# Altium project sd2snes.PrjPcb
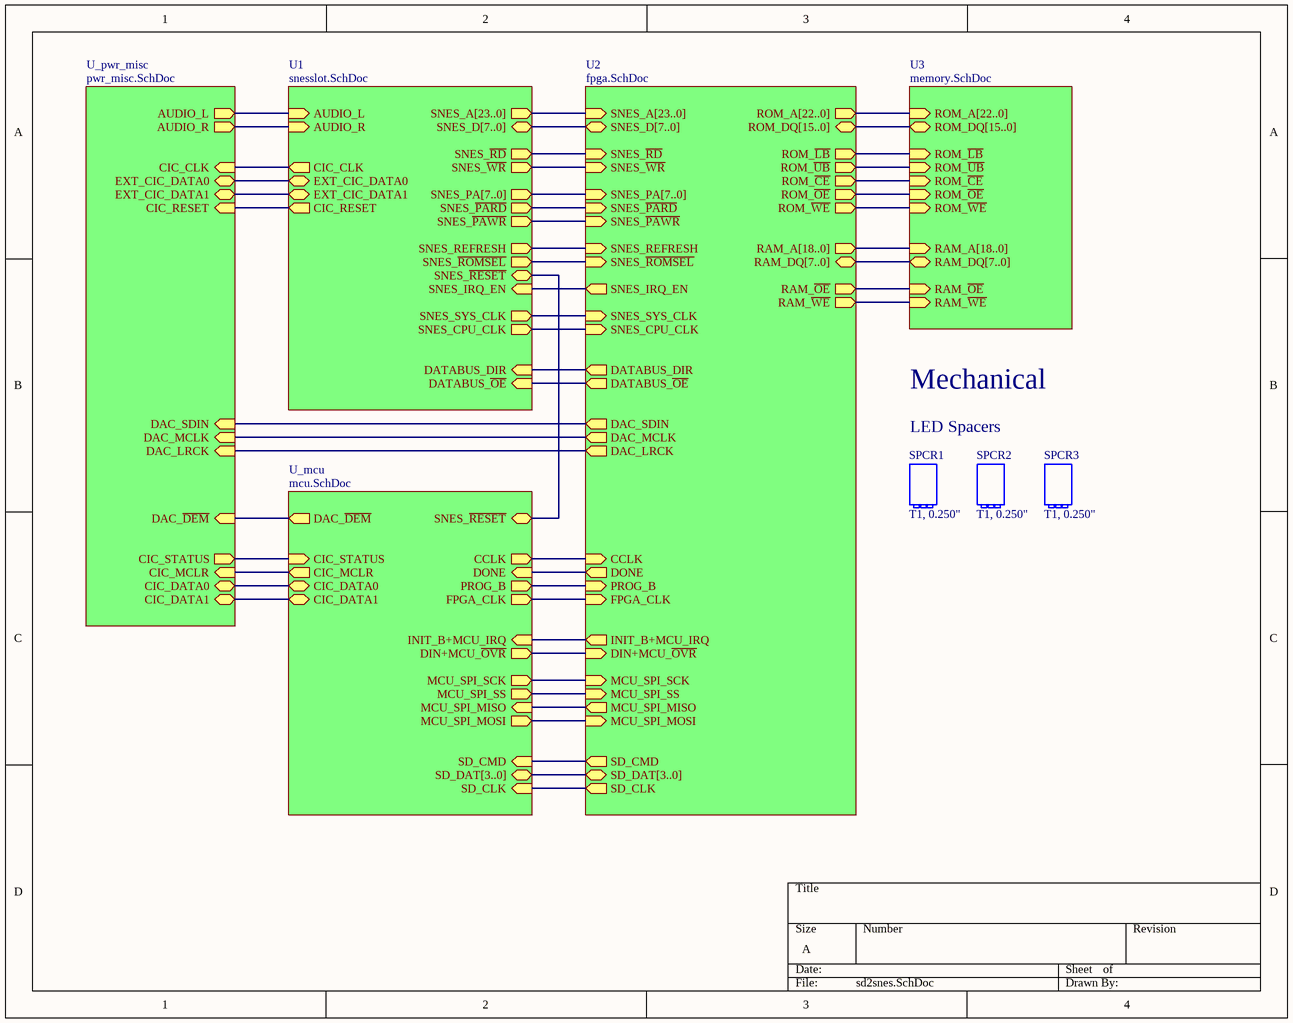
[diagram p0: sd2snes.SchDoc]
6 sheets, 156 parts. Net scope: hierarchical (ports join the sheet entries above them; power ports are global).
Board file: sd2snes.PcbDoc
Sheets:
  sd2snes.SchDoc
    U1 = snesslot.SchDoc
    U2 = fpga.SchDoc
    U3 = memory.SchDoc
    U_mcu = mcu.SchDoc
    U_pwr_misc = pwr_misc.SchDoc

## Sheet sd2snes.SchDoc
size A

### Parts
SPCR1  T1, 0.250"  (mechanical)
SPCR2  T1, 0.250"  (mechanical)
SPCR3  T1, 0.250"  (mechanical)

### Sub-sheets
U1 = snesslot.SchDoc: SNES_~{PARD} (out), SNES_~{PAWR} (out), SNES_REFRESH (out), SNES_SYS_CLK (out), SNES_~{RD} (out), SNES_~{ROMSEL} (out), SNES_IRQ_EN (in), SNES_~{RESET} (bidir), EXT_CIC_DATA1 (bidir), EXT_CIC_DATA0 (bidir), CIC_CLK (out), CIC_RESET (out), AUDIO_L (in), AUDIO_R (in), SNES_~{WR} (out), SNES_CPU_CLK (out), DATABUS_~{OE} (in), DATABUS_DIR (in), SNES_D[7..0] (bidir), SNES_A[23..0] (out), SNES_PA[7..0] (out)
U2 = fpga.SchDoc: ROM_~{WE} (out), ROM_~{OE} (out), ROM_~{UB} (out), ROM_~{CE} (out), SNES_SYS_CLK (in), ROM_~{LB} (out), SNES_REFRESH (in), SNES_~{PAWR} (in), SNES_~{PARD} (in), SNES_~{ROMSEL} (in), SNES_~{RD} (in), SNES_IRQ_EN (out), DATABUS_DIR (out), DATABUS_~{OE} (out), FPGA_CLK (in), INIT_B+MCU_IRQ (out), DIN+MCU_~{OVR} (in), SNES_~{WR} (in), SNES_CPU_CLK (in), MCU_SPI_SCK (in), DAC_SDIN (out), SD_CLK (out), MCU_SPI_SS (in), SD_CMD (out), MCU_SPI_MOSI (in), MCU_SPI_MISO (out), DAC_LRCK (out), DAC_MCLK (out), RAM_~{WE} (out), RAM_~{OE} (out), PROG_B (in), DONE (out), CCLK (in), ROM_A[22..0] (out), RAM_DQ[7..0] (bidir), ROM_DQ[15..0] (bidir), RAM_A[18..0] (out), SD_DAT[3..0] (bidir), SNES_PA[7..0] (in), SNES_D[7..0] (bidir), SNES_A[23..0] (in)
U3 = memory.SchDoc: ROM_~{CE} (in), ROM_~{OE} (in), ROM_~{WE} (in), ROM_A[22..0] (in), ROM_~{LB} (in), ROM_~{UB} (in), ROM_DQ[15..0] (bidir), RAM_A[18..0] (in), RAM_DQ[7..0] (bidir), RAM_~{OE} (in), RAM_~{WE} (in)
U_mcu = mcu.SchDoc: INIT_B+MCU_IRQ (in), DIN+MCU_~{OVR} (out), SNES_~{RESET} (bidir), CIC_STATUS (in), CIC_MCLR (out), DAC_~{DEM} (out), PROG_B (out), DONE (in), MCU_SPI_MOSI (out), MCU_SPI_MISO (in), MCU_SPI_SS (out), MCU_SPI_SCK (out), CCLK (out), FPGA_CLK (out), CIC_DATA1 (bidir), CIC_DATA0 (bidir), SD_DAT[3..0] (bidir), SD_CMD (in), SD_CLK (in)
U_pwr_misc = pwr_misc.SchDoc: CIC_CLK (in), CIC_STATUS (out), CIC_MCLR (in), CIC_DATA0 (bidir), CIC_DATA1 (bidir), EXT_CIC_DATA0 (bidir), EXT_CIC_DATA1 (bidir), CIC_RESET (in), DAC_SDIN (in), DAC_~{DEM} (in), DAC_LRCK (in), DAC_MCLK (in), AUDIO_R (out), AUDIO_L (out)

### Nets
AUDIO_L: sheet U1/AUDIO_L, sheet U_pwr_misc/AUDIO_L
AUDIO_R: sheet U1/AUDIO_R, sheet U_pwr_misc/AUDIO_R
CIC_CLK: sheet U1/CIC_CLK, sheet U_pwr_misc/CIC_CLK
CIC_DATA0: sheet U_mcu/CIC_DATA0, sheet U_pwr_misc/CIC_DATA0
CIC_DATA1: sheet U_mcu/CIC_DATA1, sheet U_pwr_misc/CIC_DATA1
CIC_MCLR: sheet U_mcu/CIC_MCLR, sheet U_pwr_misc/CIC_MCLR
CIC_RESET: sheet U1/CIC_RESET, sheet U_pwr_misc/CIC_RESET
CIC_STATUS: sheet U_mcu/CIC_STATUS, sheet U_pwr_misc/CIC_STATUS
DAC_~{DEM}: sheet U_mcu/DAC_~{DEM}, sheet U_pwr_misc/DAC_~{DEM}
DAC_LRCK: sheet U2/DAC_LRCK, sheet U_pwr_misc/DAC_LRCK
DAC_MCLK: sheet U2/DAC_MCLK, sheet U_pwr_misc/DAC_MCLK
DAC_SDIN: sheet U2/DAC_SDIN, sheet U_pwr_misc/DAC_SDIN
DATABUS_DIR: sheet U1/DATABUS_DIR, sheet U2/DATABUS_DIR
DATABUS_~{OE}: sheet U1/DATABUS_~{OE}, sheet U2/DATABUS_~{OE}
DIN+MCU_~{OVR}: sheet U2/DIN+MCU_~{OVR}, sheet U_mcu/DIN+MCU_~{OVR}
DONE: sheet U2/DONE, sheet U_mcu/DONE
EXT_CIC_DATA0: sheet U1/EXT_CIC_DATA0, sheet U_pwr_misc/EXT_CIC_DATA0
EXT_CIC_DATA1: sheet U1/EXT_CIC_DATA1, sheet U_pwr_misc/EXT_CIC_DATA1
FPGA_CLK: sheet U2/FPGA_CLK, sheet U_mcu/FPGA_CLK
INIT_B+MCU_IRQ: sheet U2/INIT_B+MCU_IRQ, sheet U_mcu/INIT_B+MCU_IRQ
MCU_SPI_MISO: sheet U2/MCU_SPI_MISO, sheet U_mcu/MCU_SPI_MISO
MCU_SPI_MOSI: sheet U2/MCU_SPI_MOSI, sheet U_mcu/MCU_SPI_MOSI
MCU_SPI_SCK: sheet U2/MCU_SPI_SCK, sheet U_mcu/MCU_SPI_SCK
MCU_SPI_SS: sheet U2/MCU_SPI_SS, sheet U_mcu/MCU_SPI_SS
PROG_B: sheet U2/PROG_B, sheet U_mcu/PROG_B
RAM_~{OE}: sheet U2/RAM_~{OE}, sheet U3/RAM_~{OE}
RAM_~{WE}: sheet U2/RAM_~{WE}, sheet U3/RAM_~{WE}
ROM_~{CE}: sheet U2/ROM_~{CE}, sheet U3/ROM_~{CE}
ROM_~{LB}: sheet U2/ROM_~{LB}, sheet U3/ROM_~{LB}
ROM_~{OE}: sheet U2/ROM_~{OE}, sheet U3/ROM_~{OE}
ROM_~{UB}: sheet U2/ROM_~{UB}, sheet U3/ROM_~{UB}
ROM_~{WE}: sheet U2/ROM_~{WE}, sheet U3/ROM_~{WE}
SD_CLK: sheet U2/SD_CLK, sheet U_mcu/SD_CLK
SD_CMD: sheet U2/SD_CMD, sheet U_mcu/SD_CMD
SNES_CPU_CLK: sheet U1/SNES_CPU_CLK, sheet U2/SNES_CPU_CLK
SNES_IRQ_EN: sheet U1/SNES_IRQ_EN, sheet U2/SNES_IRQ_EN
SNES_~{PARD}: sheet U1/SNES_~{PARD}, sheet U2/SNES_~{PARD}
SNES_~{PAWR}: sheet U1/SNES_~{PAWR}, sheet U2/SNES_~{PAWR}
SNES_~{RD}: sheet U1/SNES_~{RD}, sheet U2/SNES_~{RD}
SNES_~{RESET}: sheet U1/SNES_~{RESET}, sheet U_mcu/SNES_~{RESET}
SNES_~{ROMSEL}: sheet U1/SNES_~{ROMSEL}, sheet U2/SNES_~{ROMSEL}
SNES_REFRESH: sheet U1/SNES_REFRESH, sheet U2/SNES_REFRESH
SNES_SYS_CLK: sheet U1/SNES_SYS_CLK, sheet U2/SNES_SYS_CLK
SNES_~{WR}: sheet U1/SNES_~{WR}, sheet U2/SNES_~{WR}
NetR405_1: sheet U2/CCLK, sheet U_mcu/CCLK

### Buses and harness runs
bus sheet U1/SNES_A[23..0] = sheet U2/SNES_A[23..0]
bus sheet U1/SNES_D[7..0] = sheet U2/SNES_D[7..0]
bus sheet U1/SNES_PA[7..0] = sheet U2/SNES_PA[7..0]
bus sheet U2/RAM_A[18..0] = sheet U3/RAM_A[18..0]
bus sheet U2/RAM_DQ[7..0] = sheet U3/RAM_DQ[7..0]
bus sheet U2/ROM_A[22..0] = sheet U3/ROM_A[22..0]
bus sheet U2/ROM_DQ[15..0] = sheet U3/ROM_DQ[15..0]
bus sheet U2/SD_DAT[3..0] = sheet U_mcu/SD_DAT[3..0]

### Notes on the sheet
- Mechanical
- LED Spacers

### Library data of the parts
SPCR1-SPCR3 = LED_SPACER: LED Spacer; Value: T1, 0.250"

## Sheet snesslot.SchDoc: SD2SNES
size C; DrawnBy: Gargan; Revision: I; SheetNumber: 2; SheetTotal: 6
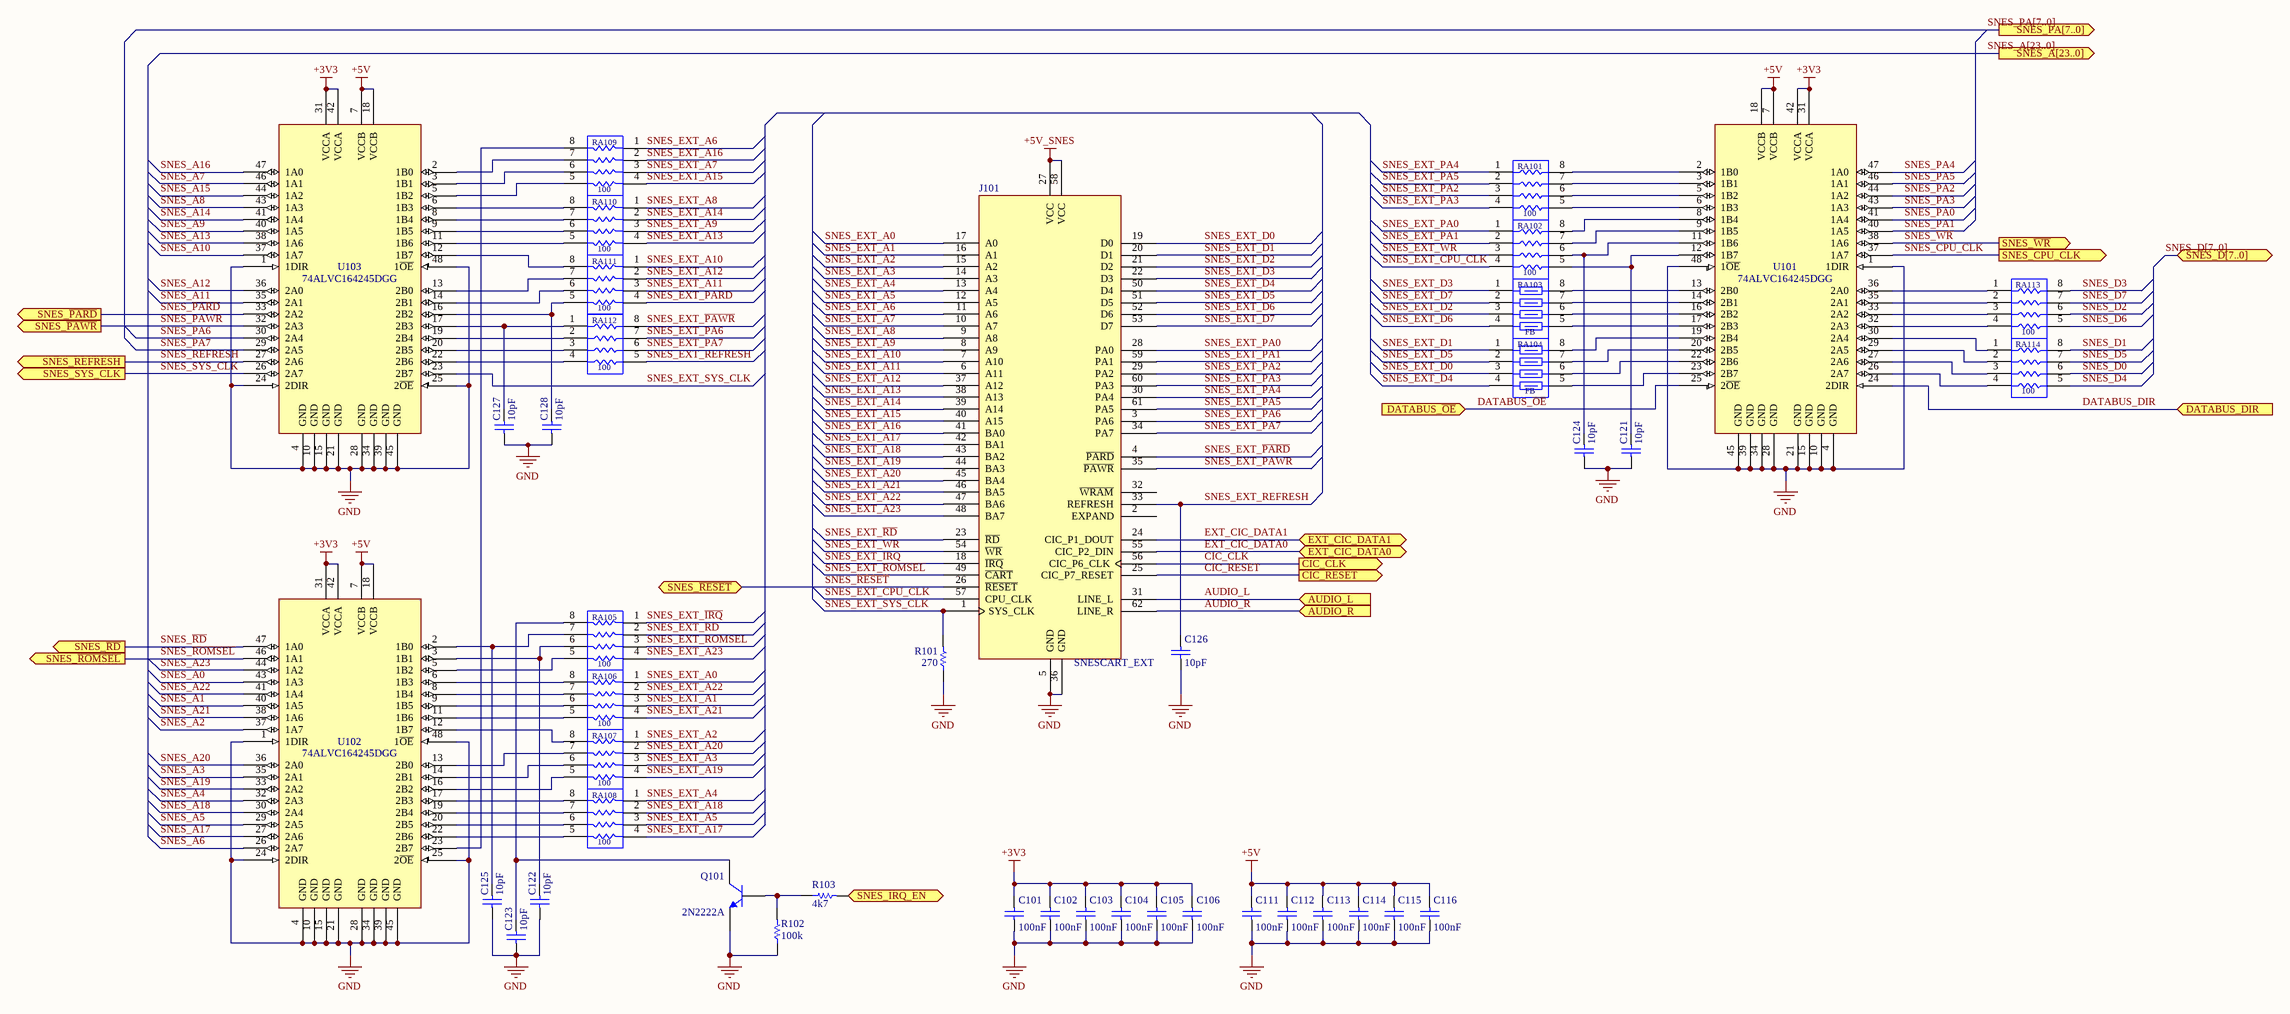
[diagram p1: snesslot.SchDoc]

### Parts
C101  100nF  [SM0805]
C102  100nF  [SM0805]
C103  100nF  [SM0805]
C104  100nF  [SM0805]
C105  100nF  [SM0805]
C106  100nF  [SM0805]
C111  100nF  [SM0805]
C112  100nF  [SM0805]
C113  100nF  [SM0805]
C114  100nF  [SM0805]
C115  100nF  [SM0805]
C116  100nF  [SM0805]
C121  10pF  [SM0805]
C122  10pF  [SM0805]
C123  10pF  [SM0805]
C124  10pF  [SM0805]
C125  10pF  [SM0805]
C126  10pF  [SM0805]
C127  10pF  [SM0805]
C128  10pF  [SM0805]
J101  SNESCART_EXT  [SNESCART_EDGE_CONN]
Q101  2N2222A  [SOT23EBC]
R101  270  [SM0805]
R102  100k  [SM0805]
R103  4k7  [SM0805]
RA101  100  [R_PACK_1206_2]
RA102  100  [R_PACK_1206_2]
RA103  FB  [R_PACK_1206_2]
RA104  FB  [R_PACK_1206_2]
RA105  100  [R_PACK_1206_2]
RA106  100  [R_PACK_1206_2]
RA107  100  [R_PACK_1206_2]
RA108  100  [R_PACK_1206_2]
RA109  100  [R_PACK_1206_2]
RA110  100  [R_PACK_1206_2]
RA111  100  [R_PACK_1206_2]
RA112  100  [R_PACK_1206_2]
RA113  100  [R_PACK_1206_2]
RA114  100  [R_PACK_1206_2]
U101  74ALVC164245DGG  [TSSOP48]
U102  74ALVC164245DGG  [TSSOP48]
U103  74ALVC164245DGG  [TSSOP48]

### Ports
AUDIO_L (in), AUDIO_R (in), CIC_CLK (out), CIC_RESET (out), DATABUS_DIR (in), DATABUS_~{OE} (in), EXT_CIC_DATA0 (bidir), EXT_CIC_DATA1 (bidir), SNES_A[23..0] (out), SNES_CPU_CLK (out), SNES_D[7..0] (bidir), SNES_IRQ_EN (in), SNES_PA[7..0] (out), SNES_REFRESH (out), SNES_SYS_CLK (out), SNES_~{PARD} (out), SNES_~{PAWR} (out), SNES_~{RD} (out), SNES_~{RESET} (bidir), SNES_~{ROMSEL} (out), SNES_~{WR} (out)

### Nets
+3V3: C101.2 C102.2 C103.2 C104.2 C105.2 C106.2 U101.31(VCCA) U101.42(VCCA) U102.31(VCCA) U102.42(VCCA) U103.31(VCCA) U103.42(VCCA)
+5V: C111.2 C112.2 C113.2 C114.2 C115.2 C116.2 U101.7(VCCB) U101.18(VCCB) U102.7(VCCB) U102.18(VCCB) U103.7(VCCB) U103.18(VCCB)
+5V_SNES: J101.27(VCC) J101.58(VCC)
GND: C101.1 C102.1 C103.1 C104.1 C105.1 C106.1 C111.1 C112.1 C113.1 C114.1 C115.1 C116.1 C121.1 C122.1 C123.1 C124.1 C125.1 C126.2 C127.1 C128.1 J101.5(GND) J101.36(GND) Q101.2(E) R101.1 R102.1 U101.1(1DIR) U101.4(GND) U101.10(GND) U101.15(GND) U101.21(GND) U101.28(GND) U101.34(GND) U101.39(GND) U101.45(GND) U101.48(1~{OE}) U102.1(1DIR) U102.4(GND) U102.10(GND) U102.15(GND) U102.21(GND) U102.24(2DIR) U102.25(2~{OE}) U102.28(GND) U102.34(GND) U102.39(GND) U102.45(GND) U102.48(1~{OE}) U103.1(1DIR) U103.4(GND) U103.10(GND) U103.15(GND) U103.21(GND) U103.24(2DIR) U103.25(2~{OE}) U103.28(GND) U103.34(GND) U103.39(GND) U103.45(GND) U103.48(1~{OE})
AUDIO_L: J101.31(LINE_L) ; port AUDIO_L
AUDIO_R: J101.62(LINE_R) ; port AUDIO_R
CIC_CLK: J101.56(CIC_P6_CLK) ; port CIC_CLK
CIC_RESET: J101.25(CIC_P7_RESET) ; port CIC_RESET
DATABUS_DIR: U101.24(2DIR) ; port DATABUS_DIR
DATABUS_~{OE}: U101.25(2~{OE}) ; port DATABUS_~{OE}
EXT_CIC_DATA0: J101.55(CIC_P2_DIN) ; port EXT_CIC_DATA0
EXT_CIC_DATA1: J101.24(CIC_P1_DOUT) ; port EXT_CIC_DATA1
SNES_A0: U102.43(1A3)
SNES_A1: U102.40(1A5)
SNES_A2: U102.37(1A7)
SNES_A3: U102.35(2A1)
SNES_A4: U102.32(2A3)
SNES_A5: U102.29(2A5)
SNES_A6: U102.26(2A7)
SNES_A7: U103.46(1A1)
SNES_A8: U103.43(1A3)
SNES_A9: U103.40(1A5)
SNES_A10: U103.37(1A7)
SNES_A11: U103.35(2A1)
SNES_A12: U103.36(2A0)
SNES_A13: U103.38(1A6)
SNES_A14: U103.41(1A4)
SNES_A15: U103.44(1A2)
SNES_A16: U103.47(1A0)
SNES_A17: U102.27(2A6)
SNES_A18: U102.30(2A4)
SNES_A19: U102.33(2A2)
SNES_A20: U102.36(2A0)
SNES_A21: U102.38(1A6)
SNES_A22: U102.41(1A4)
SNES_A23: U102.44(1A2)
SNES_CPU_CLK: U101.37(1A7) ; port SNES_CPU_CLK
SNES_D0: RA114.6
SNES_D1: RA114.8
SNES_D2: RA113.6
SNES_D3: RA113.8
SNES_D4: RA114.5
SNES_D5: RA114.7
SNES_D6: RA113.5
SNES_D7: RA113.7
SNES_EXT_A0: J101.17(A0) RA106.1
SNES_EXT_A1: J101.16(A1) RA106.3
SNES_EXT_A2: J101.15(A2) RA107.1
SNES_EXT_A3: J101.14(A3) RA107.3
SNES_EXT_A4: J101.13(A4) RA108.1
SNES_EXT_A5: J101.12(A5) RA108.3
SNES_EXT_A6: J101.11(A6) RA109.1
SNES_EXT_A7: J101.10(A7) RA109.3
SNES_EXT_A8: J101.9(A8) RA110.1
SNES_EXT_A9: J101.8(A9) RA110.3
SNES_EXT_A10: J101.7(A10) RA111.1
SNES_EXT_A11: J101.6(A11) RA111.3
SNES_EXT_A12: J101.37(A12) RA111.2
SNES_EXT_A13: J101.38(A13) RA110.4
SNES_EXT_A14: J101.39(A14) RA110.2
SNES_EXT_A15: J101.40(A15) RA109.4
SNES_EXT_A16: J101.41(BA0) RA109.2
SNES_EXT_A17: J101.42(BA1) RA108.4
SNES_EXT_A18: J101.43(BA2) RA108.2
SNES_EXT_A19: J101.44(BA3) RA107.4
SNES_EXT_A20: J101.45(BA4) RA107.2
SNES_EXT_A21: J101.46(BA5) RA106.4
SNES_EXT_A22: J101.47(BA6) RA106.2
SNES_EXT_A23: J101.48(BA7) RA105.4
SNES_EXT_CPU_CLK: J101.57(CPU_CLK) RA102.4
SNES_EXT_D0: J101.19(D0) RA104.3
SNES_EXT_D1: J101.20(D1) RA104.1
SNES_EXT_D2: J101.21(D2) RA103.3
SNES_EXT_D3: J101.22(D3) RA103.1
SNES_EXT_D4: J101.50(D4) RA104.4
SNES_EXT_D5: J101.51(D5) RA104.2
SNES_EXT_D6: J101.52(D6) RA103.4
SNES_EXT_D7: J101.53(D7) RA103.2
SNES_EXT_~{IRQ}: J101.18(~{IRQ}) RA105.1
SNES_EXT_~{PARD}: J101.4(~{PARD}) RA111.4
SNES_EXT_~{PAWR}: J101.35(~{PAWR}) RA112.8
SNES_EXT_PA0: J101.28(PA0) RA102.1
SNES_EXT_PA1: J101.59(PA1) RA102.2
SNES_EXT_PA2: J101.29(PA2) RA101.3
SNES_EXT_PA3: J101.60(PA3) RA101.4
SNES_EXT_PA4: J101.30(PA4) RA101.1
SNES_EXT_PA5: J101.61(PA5) RA101.2
SNES_EXT_PA6: J101.3(PA6) RA112.7
SNES_EXT_PA7: J101.34(PA7) RA112.6
SNES_EXT_~{RD}: J101.23(~{RD}) RA105.2
SNES_EXT_~{ROMSEL}: J101.49(~{CART}) RA105.3
SNES_EXT_REFRESH: C126.1 J101.33(REFRESH) RA112.5
SNES_EXT_SYS_CLK: J101.1(SYS_CLK) R101.2 U103.23(2B7)
SNES_EXT_~{WR}: J101.54(~{WR}) RA102.3
SNES_IRQ_EN: R103.2 ; port SNES_IRQ_EN
SNES_~{PARD}: U103.33(2A2) ; port SNES_~{PARD}
SNES_~{PAWR}: U103.32(2A3) ; port SNES_~{PAWR}
SNES_PA0: U101.41(1A4)
SNES_PA1: U101.40(1A5)
SNES_PA2: U101.44(1A2)
SNES_PA3: U101.43(1A3)
SNES_PA4: U101.47(1A0)
SNES_PA5: U101.46(1A1)
SNES_PA6: U103.30(2A4)
SNES_PA7: U103.29(2A5)
SNES_~{RD}: U102.47(1A0) ; port SNES_~{RD}
SNES_~{RESET}: J101.26(~{RESET}) ; port SNES_~{RESET}
SNES_~{ROMSEL}: U102.46(1A1) ; port SNES_~{ROMSEL}
SNES_REFRESH: U103.27(2A6) ; port SNES_REFRESH
SNES_SYS_CLK: U103.26(2A7) ; port SNES_SYS_CLK
SNES_~{WR}: U101.38(1A6) ; port SNES_~{WR}
NetC121_2: C121.2 RA102.5 U101.12(1B7)
NetC122_2: C122.2 RA105.6 U102.3(1B1)
NetC123_2: C123.2 Q101.3(C) RA105.8
NetC124_2: C124.2 RA102.6 U101.11(1B6)
NetC125_2: C125.2 RA105.7 U102.2(1B0)
NetC127_2: C127.2 RA112.1 U103.17(2B3)
NetC128_2: C128.2 RA111.5 U103.16(2B2)
NetQ101_1: Q101.1(B) R102.2 R103.1
NetRA101_5: RA101.5 U101.6(1B3)
NetRA101_6: RA101.6 U101.5(1B2)
NetRA101_7: RA101.7 U101.3(1B1)
NetRA101_8: RA101.8 U101.2(1B0)
NetRA102_7: RA102.7 U101.9(1B5)
NetRA102_8: RA102.8 U101.8(1B4)
NetRA103_5: RA103.5 U101.17(2B3)
NetRA103_6: RA103.6 U101.16(2B2)
NetRA103_7: RA103.7 U101.14(2B1)
NetRA103_8: RA103.8 U101.13(2B0)
NetRA104_5: RA104.5 U101.23(2B7)
NetRA104_6: RA104.6 U101.22(2B6)
NetRA104_7: RA104.7 U101.20(2B5)
NetRA104_8: RA104.8 U101.19(2B4)
NetRA105_5: RA105.5 U102.5(1B2)
NetRA106_5: RA106.5 U102.11(1B6)
NetRA106_6: RA106.6 U102.9(1B5)
NetRA106_7: RA106.7 U102.8(1B4)
NetRA106_8: RA106.8 U102.6(1B3)
NetRA107_5: RA107.5 U102.16(2B2)
NetRA107_6: RA107.6 U102.14(2B1)
NetRA107_7: RA107.7 U102.13(2B0)
NetRA107_8: RA107.8 U102.12(1B7)
NetRA108_5: RA108.5 U102.22(2B6)
NetRA108_6: RA108.6 U102.20(2B5)
NetRA108_7: RA108.7 U102.19(2B4)
NetRA108_8: RA108.8 U102.17(2B3)
NetRA109_5: RA109.5 U103.5(1B2)
NetRA109_6: RA109.6 U103.3(1B1)
NetRA109_7: RA109.7 U103.2(1B0)
NetRA109_8: RA109.8 U102.23(2B7)
NetRA110_5: RA110.5 U103.11(1B6)
NetRA110_6: RA110.6 U103.9(1B5)
NetRA110_7: RA110.7 U103.8(1B4)
NetRA110_8: RA110.8 U103.6(1B3)
NetRA111_6: RA111.6 U103.14(2B1)
NetRA111_7: RA111.7 U103.13(2B0)
NetRA111_8: RA111.8 U103.12(1B7)
NetRA112_2: RA112.2 U103.19(2B4)
NetRA112_3: RA112.3 U103.20(2B5)
NetRA112_4: RA112.4 U103.22(2B6)
NetRA113_1: RA113.1 U101.36(2A0)
NetRA113_2: RA113.2 U101.35(2A1)
NetRA113_3: RA113.3 U101.33(2A2)
NetRA113_4: RA113.4 U101.32(2A3)
NetRA114_1: RA114.1 U101.30(2A4)
NetRA114_2: RA114.2 U101.29(2A5)
NetRA114_3: RA114.3 U101.27(2A6)
NetRA114_4: RA114.4 U101.26(2A7)

Not connected (* = marked no-connect by the designer): J101 2(EXPAND) 32(~{WRAM})

### Buses and harness runs
bus SNES_A[23..0] = port SNES_A[23..0]
bus SNES_D[7..0] = port SNES_D[7..0]
bus SNES_PA[7..0] = port SNES_PA[7..0]

### Library data of the parts
C101-C106 C111-C116 C121-C128 = Cap: Capacitor
  C101-C106 C111-C116: Value: 100nF
  C121-C128: Value: 10pF
Q101 = NPN: NPN Transistor
R101-R103 = Res1: Resistor
  R101: Value: 270
  R102: Value: 100k
  R103: Value: 4k7
RA101 RA102 RA105-RA114 = R_PACK4: Four Resistor Array
RA103 RA104 = FB_PACK4: Four Ferrite Bead Array
U101-U103 = 74ALVC164245

## Sheet fpga.SchDoc
size C
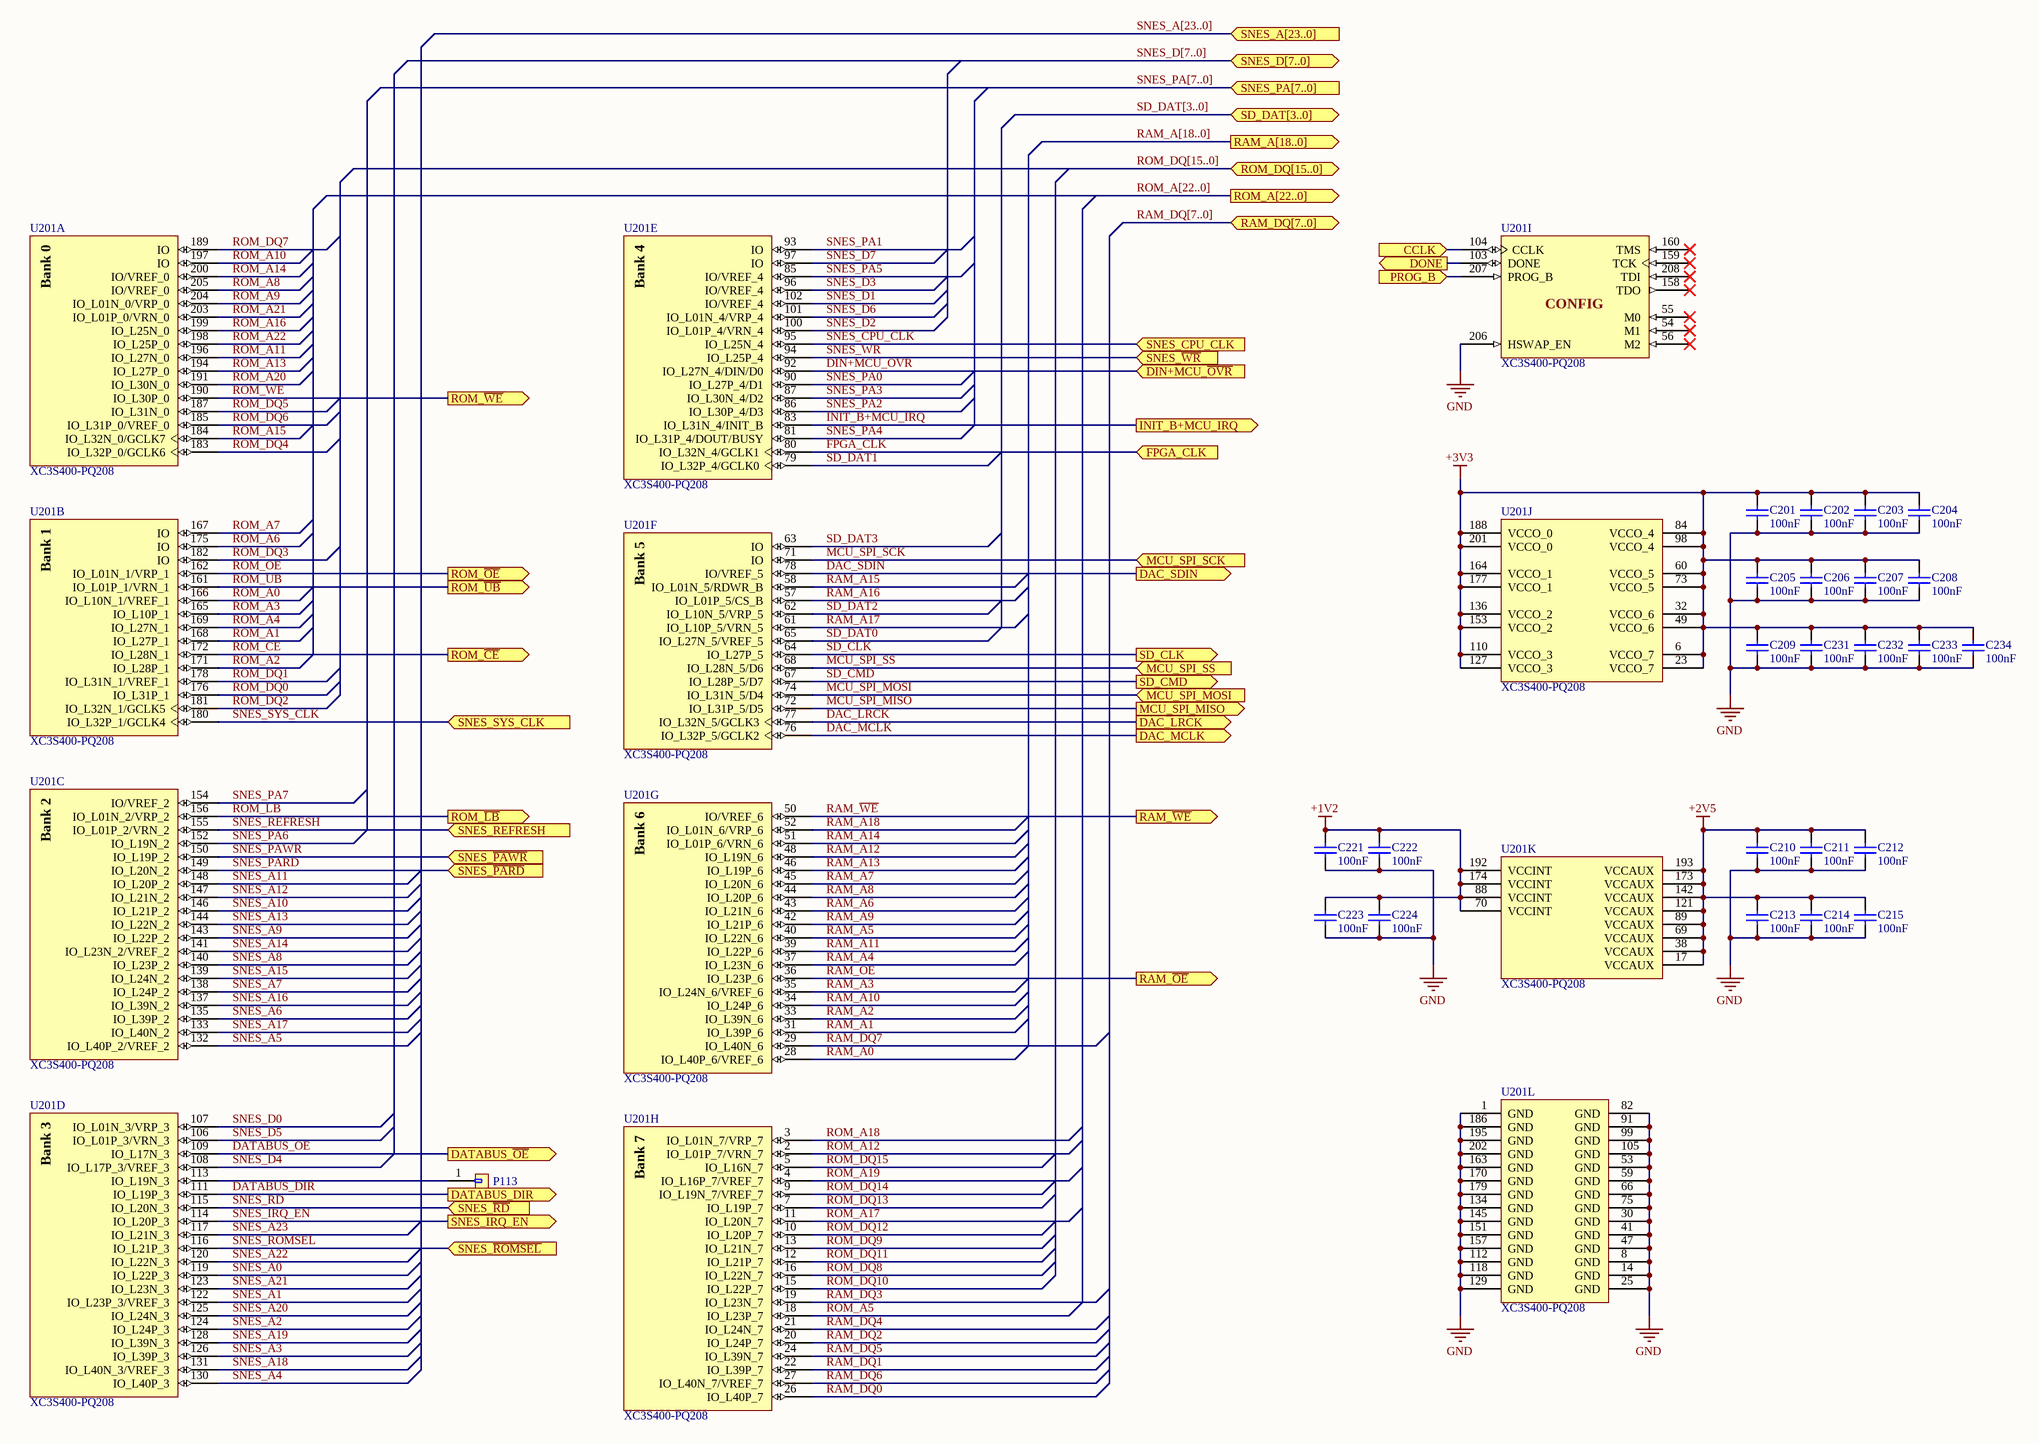
[diagram p2: fpga.SchDoc]

### Parts
C201  100nF  [SM0805]
C202  100nF  [SM0805]
C203  100nF  [SM0805]
C204  100nF  [SM0805]
C205  100nF  [SM0805]
C206  100nF  [SM0805]
C207  100nF  [SM0805]
C208  100nF  [SM0805]
C209  100nF  [SM0805]
C210  100nF  [SM0805]
C211  100nF  [SM0805]
C212  100nF  [SM0805]
C213  100nF  [SM0805]
C214  100nF  [SM0805]
C215  100nF  [SM0805]
C221  100nF  [SM0805]
C222  100nF  [SM0805]
C223  100nF  [SM0805]
C224  100nF  [SM0805]
C231  100nF  [SM0805]
C232  100nF  [SM0805]
C233  100nF  [SM0805]
C234  100nF  [SM0805]
P113  CONN_1  [CONN_1]  (value not drawn)
U201  XC3S400-PQ208  [PQFP208]  (parts A,B,C,D,E,F,G,H,I,J,K,L of 12)

### Ports
CCLK (in), DAC_LRCK (out), DAC_MCLK (out), DAC_SDIN (out), DATABUS_DIR (out), DATABUS_~{OE} (out), DIN+MCU_~{OVR} (in), DONE (out), FPGA_CLK (in), INIT_B+MCU_IRQ (out), MCU_SPI_MISO (out), MCU_SPI_MOSI (in), MCU_SPI_SCK (in), MCU_SPI_SS (in), PROG_B (in), RAM_A[18..0] (out), RAM_DQ[7..0] (bidir), RAM_~{OE} (out), RAM_~{WE} (out), ROM_A[22..0] (out), ROM_DQ[15..0] (bidir), ROM_~{CE} (out), ROM_~{LB} (out), ROM_~{OE} (out), ROM_~{UB} (out), ROM_~{WE} (out), SD_CLK (out), SD_CMD (out), SD_DAT[3..0] (bidir), SNES_A[23..0] (in), SNES_CPU_CLK (in), SNES_D[7..0] (bidir), SNES_IRQ_EN (out), SNES_PA[7..0] (in), SNES_REFRESH (in), SNES_SYS_CLK (in), SNES_~{PARD} (in), SNES_~{PAWR} (in), SNES_~{RD} (in), SNES_~{ROMSEL} (in), SNES_~{WR} (in)

### Nets
+1V2: C221.1 C222.1 C223.1 C224.1 U201.70(VCCINT) U201.88(VCCINT) U201.174(VCCINT) U201.192(VCCINT)
+2V5: C210.1 C211.1 C212.1 C213.1 C214.1 C215.1 U201.17(VCCAUX) U201.38(VCCAUX) U201.69(VCCAUX) U201.89(VCCAUX) U201.121(VCCAUX) U201.142(VCCAUX) U201.173(VCCAUX) U201.193(VCCAUX)
+3V3: C201.1 C202.1 C203.1 C204.1 C205.1 C206.1 C207.1 C208.1 C209.1 C231.1 C232.1 C233.1 C234.1 U201.6(VCCO_7) U201.23(VCCO_7) U201.32(VCCO_6) U201.49(VCCO_6) U201.60(VCCO_5) U201.73(VCCO_5) U201.84(VCCO_4) U201.98(VCCO_4) U201.110(VCCO_3) U201.127(VCCO_3) U201.136(VCCO_2) U201.153(VCCO_2) U201.164(VCCO_1) U201.177(VCCO_1) U201.188(VCCO_0) U201.201(VCCO_0)
GND: C201.2 C202.2 C203.2 C204.2 C205.2 C206.2 C207.2 C208.2 C209.2 C210.2 C211.2 C212.2 C213.2 C214.2 C215.2 C221.2 C222.2 C223.2 C224.2 C231.2 C232.2 C233.2 C234.2 U201.1(GND) U201.8(GND) U201.14(GND) U201.25(GND) U201.30(GND) U201.41(GND) U201.47(GND) U201.53(GND) U201.59(GND) U201.66(GND) U201.75(GND) U201.82(GND) U201.91(GND) U201.99(GND) U201.105(GND) U201.112(GND) U201.118(GND) U201.129(GND) U201.134(GND) U201.145(GND) U201.151(GND) U201.157(GND) U201.163(GND) U201.170(GND) U201.179(GND) U201.186(GND) U201.195(GND) U201.202(GND) U201.206(HSWAP_EN)
DAC_LRCK: U201.77(IO_L32N_5/GCLK3) ; port DAC_LRCK
DAC_MCLK: U201.76(IO_L32P_5/GCLK2) ; port DAC_MCLK
DAC_SDIN: U201.78(IO/VREF_5) ; port DAC_SDIN
DATABUS_DIR: U201.111(IO_L19P_3) ; port DATABUS_DIR
DATABUS_~{OE}: U201.109(IO_L17N_3) ; port DATABUS_~{OE}
DIN+MCU_~{OVR}: U201.92(IO_L27N_4/DIN/D0) ; port DIN+MCU_~{OVR}
DONE: U201.103(DONE) ; port DONE
FPGA_CLK: U201.80(IO_L32N_4/GCLK1) ; port FPGA_CLK
INIT_B+MCU_IRQ: U201.83(IO_L31N_4/INIT_B) ; port INIT_B+MCU_IRQ
MCU_SPI_MISO: U201.72(IO_L31P_5/D5) ; port MCU_SPI_MISO
MCU_SPI_MOSI: U201.74(IO_L31N_5/D4) ; port MCU_SPI_MOSI
MCU_SPI_SCK: U201.71(IO) ; port MCU_SPI_SCK
MCU_SPI_SS: U201.68(IO_L28N_5/D6) ; port MCU_SPI_SS
PROG_B: U201.207(PROG_B) ; port PROG_B
RAM_A0: U201.28(IO_L40P_6/VREF_6)
RAM_A1: U201.31(IO_L39P_6)
RAM_A2: U201.33(IO_L39N_6)
RAM_A3: U201.35(IO_L24N_6/VREF_6)
RAM_A4: U201.37(IO_L23N_6)
RAM_A5: U201.40(IO_L22N_6)
RAM_A6: U201.43(IO_L21N_6)
RAM_A7: U201.45(IO_L20N_6)
RAM_A8: U201.44(IO_L20P_6)
RAM_A9: U201.42(IO_L21P_6)
RAM_A10: U201.34(IO_L24P_6)
RAM_A11: U201.39(IO_L22P_6)
RAM_A12: U201.48(IO_L19N_6)
RAM_A13: U201.46(IO_L19P_6)
RAM_A14: U201.51(IO_L01P_6/VRN_6)
RAM_A15: U201.58(IO_L01N_5/RDWR_B)
RAM_A16: U201.57(IO_L01P_5/CS_B)
RAM_A17: U201.61(IO_L10P_5/VRN_5)
RAM_A18: U201.52(IO_L01N_6/VRP_6)
RAM_DQ0: U201.26(IO_L40P_7)
RAM_DQ1: U201.22(IO_L39P_7)
RAM_DQ2: U201.20(IO_L24P_7)
RAM_DQ3: U201.19(IO_L23N_7)
RAM_DQ4: U201.21(IO_L24N_7)
RAM_DQ5: U201.24(IO_L39N_7)
RAM_DQ6: U201.27(IO_L40N_7/VREF_7)
RAM_DQ7: U201.29(IO_L40N_6)
RAM_~{OE}: U201.36(IO_L23P_6) ; port RAM_~{OE}
RAM_~{WE}: U201.50(IO/VREF_6) ; port RAM_~{WE}
ROM_A0: U201.166(IO_L10N_1/VREF_1)
ROM_A1: U201.168(IO_L27P_1)
ROM_A2: U201.171(IO_L28P_1)
ROM_A3: U201.165(IO_L10P_1)
ROM_A4: U201.169(IO_L27N_1)
ROM_A5: U201.18(IO_L23P_7)
ROM_A6: U201.175(IO)
ROM_A7: U201.167(IO)
ROM_A8: U201.205(IO/VREF_0)
ROM_A9: U201.204(IO_L01N_0/VRP_0)
ROM_A10: U201.197(IO)
ROM_A11: U201.196(IO_L27N_0)
ROM_A12: U201.2(IO_L01P_7/VRN_7)
ROM_A13: U201.194(IO_L27P_0)
ROM_A14: U201.200(IO/VREF_0)
ROM_A15: U201.184(IO_L32N_0/GCLK7)
ROM_A16: U201.199(IO_L25N_0)
ROM_A17: U201.11(IO_L20N_7)
ROM_A18: U201.3(IO_L01N_7/VRP_7)
ROM_A19: U201.4(IO_L16P_7/VREF_7)
ROM_A20: U201.191(IO_L30N_0)
ROM_A21: U201.203(IO_L01P_0/VRN_0)
ROM_A22: U201.198(IO_L25P_0)
ROM_~{CE}: U201.172(IO_L28N_1) ; port ROM_~{CE}
ROM_DQ0: U201.176(IO_L31P_1)
ROM_DQ1: U201.178(IO_L31N_1/VREF_1)
ROM_DQ2: U201.181(IO_L32N_1/GCLK5)
ROM_DQ3: U201.182(IO)
ROM_DQ4: U201.183(IO_L32P_0/GCLK6)
ROM_DQ5: U201.187(IO_L31N_0)
ROM_DQ6: U201.185(IO_L31P_0/VREF_0)
ROM_DQ7: U201.189(IO)
ROM_DQ8: U201.16(IO_L22N_7)
ROM_DQ9: U201.13(IO_L21N_7)
ROM_DQ10: U201.15(IO_L22P_7)
ROM_DQ11: U201.12(IO_L21P_7)
ROM_DQ12: U201.10(IO_L20P_7)
ROM_DQ13: U201.7(IO_L19P_7)
ROM_DQ14: U201.9(IO_L19N_7/VREF_7)
ROM_DQ15: U201.5(IO_L16N_7)
ROM_~{LB}: U201.156(IO_L01N_2/VRP_2) ; port ROM_~{LB}
ROM_~{OE}: U201.162(IO_L01N_1/VRP_1) ; port ROM_~{OE}
ROM_~{UB}: U201.161(IO_L01P_1/VRN_1) ; port ROM_~{UB}
ROM_~{WE}: U201.190(IO_L30P_0) ; port ROM_~{WE}
SD_CLK: U201.64(IO_L27P_5) ; port SD_CLK
SD_CMD: U201.67(IO_L28P_5/D7) ; port SD_CMD
SD_DAT0: U201.65(IO_L27N_5/VREF_5)
SD_DAT1: U201.79(IO_L32P_4/GCLK0)
SD_DAT2: U201.62(IO_L10N_5/VRP_5)
SD_DAT3: U201.63(IO)
SNES_A0: U201.119(IO_L22P_3)
SNES_A1: U201.122(IO_L23P_3/VREF_3)
SNES_A2: U201.124(IO_L24P_3)
SNES_A3: U201.126(IO_L39P_3)
SNES_A4: U201.130(IO_L40P_3)
SNES_A5: U201.132(IO_L40P_2/VREF_2)
SNES_A6: U201.135(IO_L39P_2)
SNES_A7: U201.138(IO_L24P_2)
SNES_A8: U201.140(IO_L23P_2)
SNES_A9: U201.143(IO_L22P_2)
SNES_A10: U201.146(IO_L21P_2)
SNES_A11: U201.148(IO_L20P_2)
SNES_A12: U201.147(IO_L21N_2)
SNES_A13: U201.144(IO_L22N_2)
SNES_A14: U201.141(IO_L23N_2/VREF_2)
SNES_A15: U201.139(IO_L24N_2)
SNES_A16: U201.137(IO_L39N_2)
SNES_A17: U201.133(IO_L40N_2)
SNES_A18: U201.131(IO_L40N_3/VREF_3)
SNES_A19: U201.128(IO_L39N_3)
SNES_A20: U201.125(IO_L24N_3)
SNES_A21: U201.123(IO_L23N_3)
SNES_A22: U201.120(IO_L22N_3)
SNES_A23: U201.117(IO_L21N_3)
SNES_CPU_CLK: U201.95(IO_L25N_4) ; port SNES_CPU_CLK
SNES_D0: U201.107(IO_L01N_3/VRP_3)
SNES_D1: U201.102(IO/VREF_4)
SNES_D2: U201.100(IO_L01P_4/VRN_4)
SNES_D3: U201.96(IO/VREF_4)
SNES_D4: U201.108(IO_L17P_3/VREF_3)
SNES_D5: U201.106(IO_L01P_3/VRN_3)
SNES_D6: U201.101(IO_L01N_4/VRP_4)
SNES_D7: U201.97(IO)
SNES_IRQ_EN: U201.114(IO_L20P_3) ; port SNES_IRQ_EN
SNES_~{PARD}: U201.149(IO_L20N_2) ; port SNES_~{PARD}
SNES_~{PAWR}: U201.150(IO_L19P_2) ; port SNES_~{PAWR}
SNES_PA0: U201.90(IO_L27P_4/D1)
SNES_PA1: U201.93(IO)
SNES_PA2: U201.86(IO_L30P_4/D3)
SNES_PA3: U201.87(IO_L30N_4/D2)
SNES_PA4: U201.81(IO_L31P_4/DOUT/BUSY)
SNES_PA5: U201.85(IO/VREF_4)
SNES_PA6: U201.152(IO_L19N_2)
SNES_PA7: U201.154(IO/VREF_2)
SNES_~{RD}: U201.115(IO_L20N_3) ; port SNES_~{RD}
SNES_~{ROMSEL}: U201.116(IO_L21P_3) ; port SNES_~{ROMSEL}
SNES_REFRESH: U201.155(IO_L01P_2/VRN_2) ; port SNES_REFRESH
SNES_SYS_CLK: U201.180(IO_L32P_1/GCLK4) ; port SNES_SYS_CLK
SNES_~{WR}: U201.94(IO_L25P_4) ; port SNES_~{WR}
NetP113_1: P113.1 U201.113(IO_L19N_3)
NetR405_1: U201.104(CCLK) ; port CCLK

Not connected (* = marked no-connect by the designer): U201 54(M1)* 55(M0)* 56(M2)* 158(TDO)* 159(TCK)* 160(TMS)* 208(TDI)*

### Buses and harness runs
bus RAM_A[18..0] = port RAM_A[18..0]
bus RAM_DQ[7..0] = port RAM_DQ[7..0]
bus ROM_A[22..0] = port ROM_A[22..0]
bus ROM_DQ[15..0] = port ROM_DQ[15..0]
bus SD_DAT[3..0] = port SD_DAT[3..0]
bus SNES_A[23..0] = port SNES_A[23..0]
bus SNES_D[7..0] = port SNES_D[7..0]
bus SNES_PA[7..0] = port SNES_PA[7..0]

### Notes on the sheet
- (in symbol XC3S400-PQ208, part A) Bank 0
- (in symbol XC3S400-PQ208, part B) Bank 1
- (in symbol XC3S400-PQ208, part C) Bank 2
- (in symbol XC3S400-PQ208, part D) Bank 3
- (in symbol XC3S400-PQ208, part E) Bank 4
- (in symbol XC3S400-PQ208, part F) Bank 5
- (in symbol XC3S400-PQ208, part G) Bank 6
- (in symbol XC3S400-PQ208, part H) Bank 7
- (in symbol XC3S400-PQ208, part I) CONFIG

### Library data of the parts
C201-C215 C221-C224 C231-C234 = Cap: Capacitor; Value: 100nF

## Sheet memory.SchDoc
size C
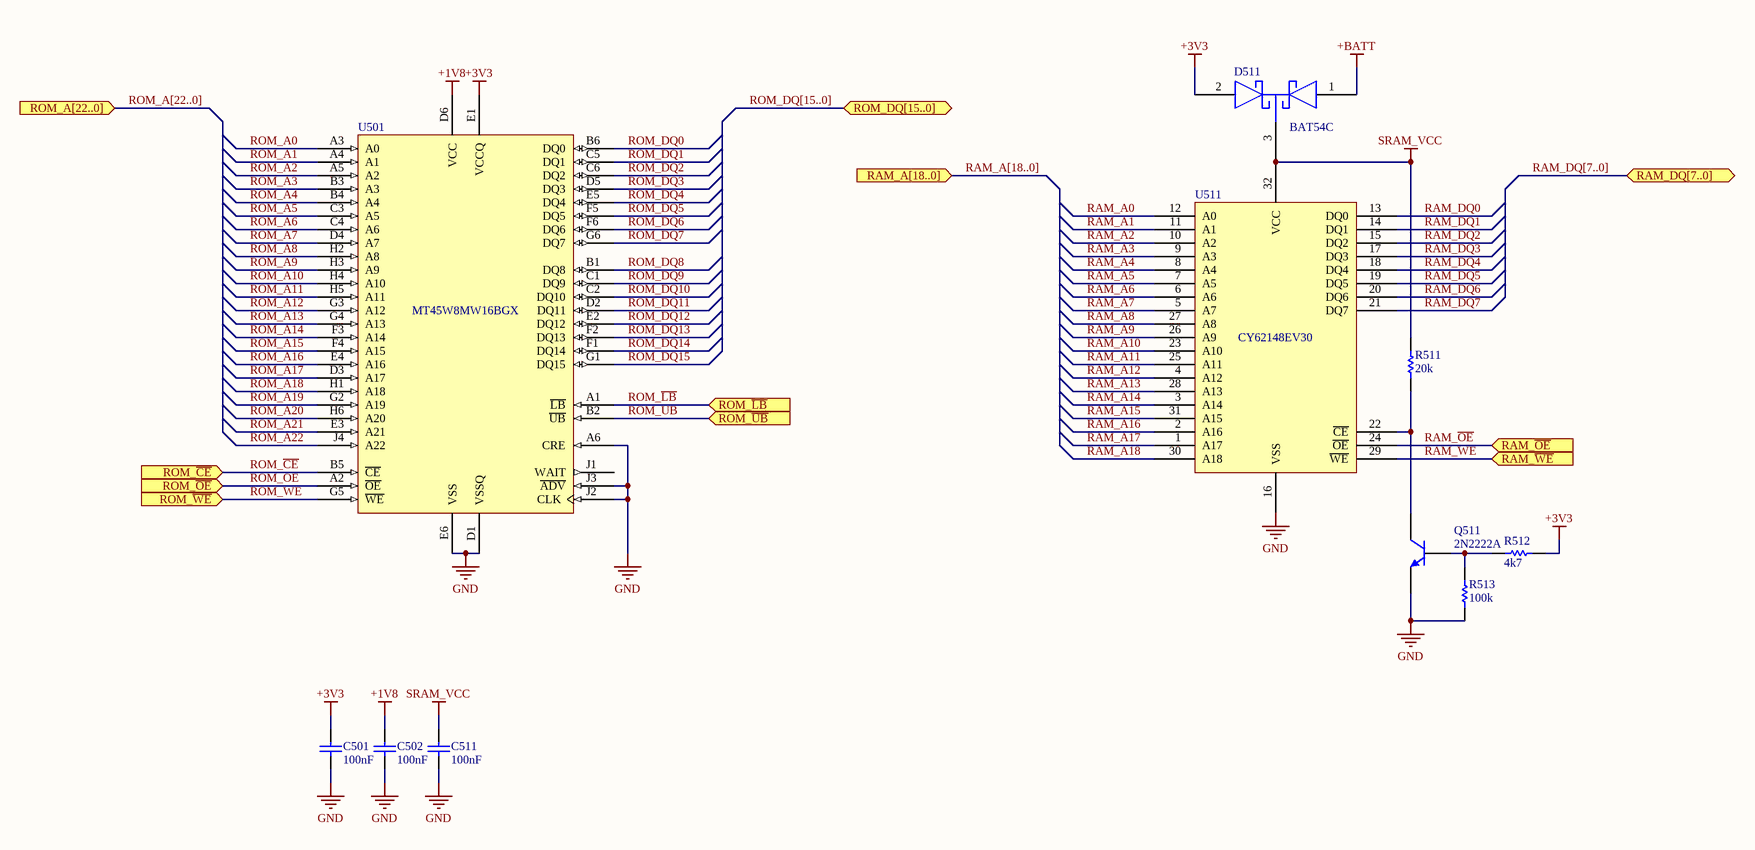
[diagram p3: memory.SchDoc]

### Parts
C501  100nF  [SM0805]
C502  100nF  [SM0805]
C511  100nF  [SM0805]
D511  BAT54C  [SOT23EBC]
Q511  2N2222A  [SOT23EBC]
R511  20k  [SM0805]
R512  4k7  [SM0805]
R513  100k  [SM0805]
U501  MT45W8MW16BGX  [VFBGA54]
U511  CY62148EV30  [TSOPII-32]

### Ports
RAM_A[18..0] (in), RAM_DQ[7..0] (bidir), RAM_~{OE} (in), RAM_~{WE} (in), ROM_A[22..0] (in), ROM_DQ[15..0] (bidir), ROM_~{CE} (in), ROM_~{LB} (in), ROM_~{OE} (in), ROM_~{UB} (in), ROM_~{WE} (in)

### Nets
+1V8: C502.1 U501.D6(VCC)
+3V3: C501.1 D511.2 R512.2 U501.E1(VCCQ)
+BATT: D511.1
GND: C501.2 C502.2 C511.2 Q511.2(E) R513.2 U501.A6(CRE) U501.D1(VSSQ) U501.E6(VSS) U501.J2(CLK) U501.J3(~{ADV}) U511.16(VSS)
SRAM_VCC: C511.1 D511.3 R511.1 U511.32(VCC)
RAM_A0: U511.12(A0)
RAM_A1: U511.11(A1)
RAM_A2: U511.10(A2)
RAM_A3: U511.9(A3)
RAM_A4: U511.8(A4)
RAM_A5: U511.7(A5)
RAM_A6: U511.6(A6)
RAM_A7: U511.5(A7)
RAM_A8: U511.27(A8)
RAM_A9: U511.26(A9)
RAM_A10: U511.23(A10)
RAM_A11: U511.25(A11)
RAM_A12: U511.4(A12)
RAM_A13: U511.28(A13)
RAM_A14: U511.3(A14)
RAM_A15: U511.31(A15)
RAM_A16: U511.2(A16)
RAM_A17: U511.1(A17)
RAM_A18: U511.30(A18)
RAM_DQ0: U511.13(DQ0)
RAM_DQ1: U511.14(DQ1)
RAM_DQ2: U511.15(DQ2)
RAM_DQ3: U511.17(DQ3)
RAM_DQ4: U511.18(DQ4)
RAM_DQ5: U511.19(DQ5)
RAM_DQ6: U511.20(DQ6)
RAM_DQ7: U511.21(DQ7)
RAM_~{OE}: U511.24(~{OE}) ; port RAM_~{OE}
RAM_~{WE}: U511.29(~{WE}) ; port RAM_~{WE}
ROM_A0: U501.A3(A0)
ROM_A1: U501.A4(A1)
ROM_A2: U501.A5(A2)
ROM_A3: U501.B3(A3)
ROM_A4: U501.B4(A4)
ROM_A5: U501.C3(A5)
ROM_A6: U501.C4(A6)
ROM_A7: U501.D4(A7)
ROM_A8: U501.H2(A8)
ROM_A9: U501.H3(A9)
ROM_A10: U501.H4(A10)
ROM_A11: U501.H5(A11)
ROM_A12: U501.G3(A12)
ROM_A13: U501.G4(A13)
ROM_A14: U501.F3(A14)
ROM_A15: U501.F4(A15)
ROM_A16: U501.E4(A16)
ROM_A17: U501.D3(A17)
ROM_A18: U501.H1(A18)
ROM_A19: U501.G2(A19)
ROM_A20: U501.H6(A20)
ROM_A21: U501.E3(A21)
ROM_A22: U501.J4(A22)
ROM_~{CE}: U501.B5(~{CE}) ; port ROM_~{CE}
ROM_DQ0: U501.B6(DQ0)
ROM_DQ1: U501.C5(DQ1)
ROM_DQ2: U501.C6(DQ2)
ROM_DQ3: U501.D5(DQ3)
ROM_DQ4: U501.E5(DQ4)
ROM_DQ5: U501.F5(DQ5)
ROM_DQ6: U501.F6(DQ6)
ROM_DQ7: U501.G6(DQ7)
ROM_DQ8: U501.B1(DQ8)
ROM_DQ9: U501.C1(DQ9)
ROM_DQ10: U501.C2(DQ10)
ROM_DQ11: U501.D2(DQ11)
ROM_DQ12: U501.E2(DQ12)
ROM_DQ13: U501.F2(DQ13)
ROM_DQ14: U501.F1(DQ14)
ROM_DQ15: U501.G1(DQ15)
ROM_~{LB}: U501.A1(~{LB}) ; port ROM_~{LB}
ROM_~{OE}: U501.A2(~{OE}) ; port ROM_~{OE}
ROM_~{UB}: U501.B2(~{UB}) ; port ROM_~{UB}
ROM_~{WE}: U501.G5(~{WE}) ; port ROM_~{WE}
NetQ511_1: Q511.1(B) R512.1 R513.1
NetQ511_3: Q511.3(C) R511.2 U511.22(~{CE})

Not connected (* = marked no-connect by the designer): U501 J1(WAIT)

### Buses and harness runs
bus RAM_A[18..0] = port RAM_A[18..0]
bus RAM_DQ[7..0] = port RAM_DQ[7..0]
bus ROM_A[22..0] = port ROM_A[22..0]
bus ROM_DQ[15..0] = port ROM_DQ[15..0]

### Library data of the parts
C501 C502 C511 = Cap: Capacitor; Value: 100nF
Q511 = NPN: NPN Transistor
R511-R513 = Res1: Resistor
  R511: Value: 20k
  R512: Value: 4k7
  R513: Value: 100k

## Sheet mcu.SchDoc
size B
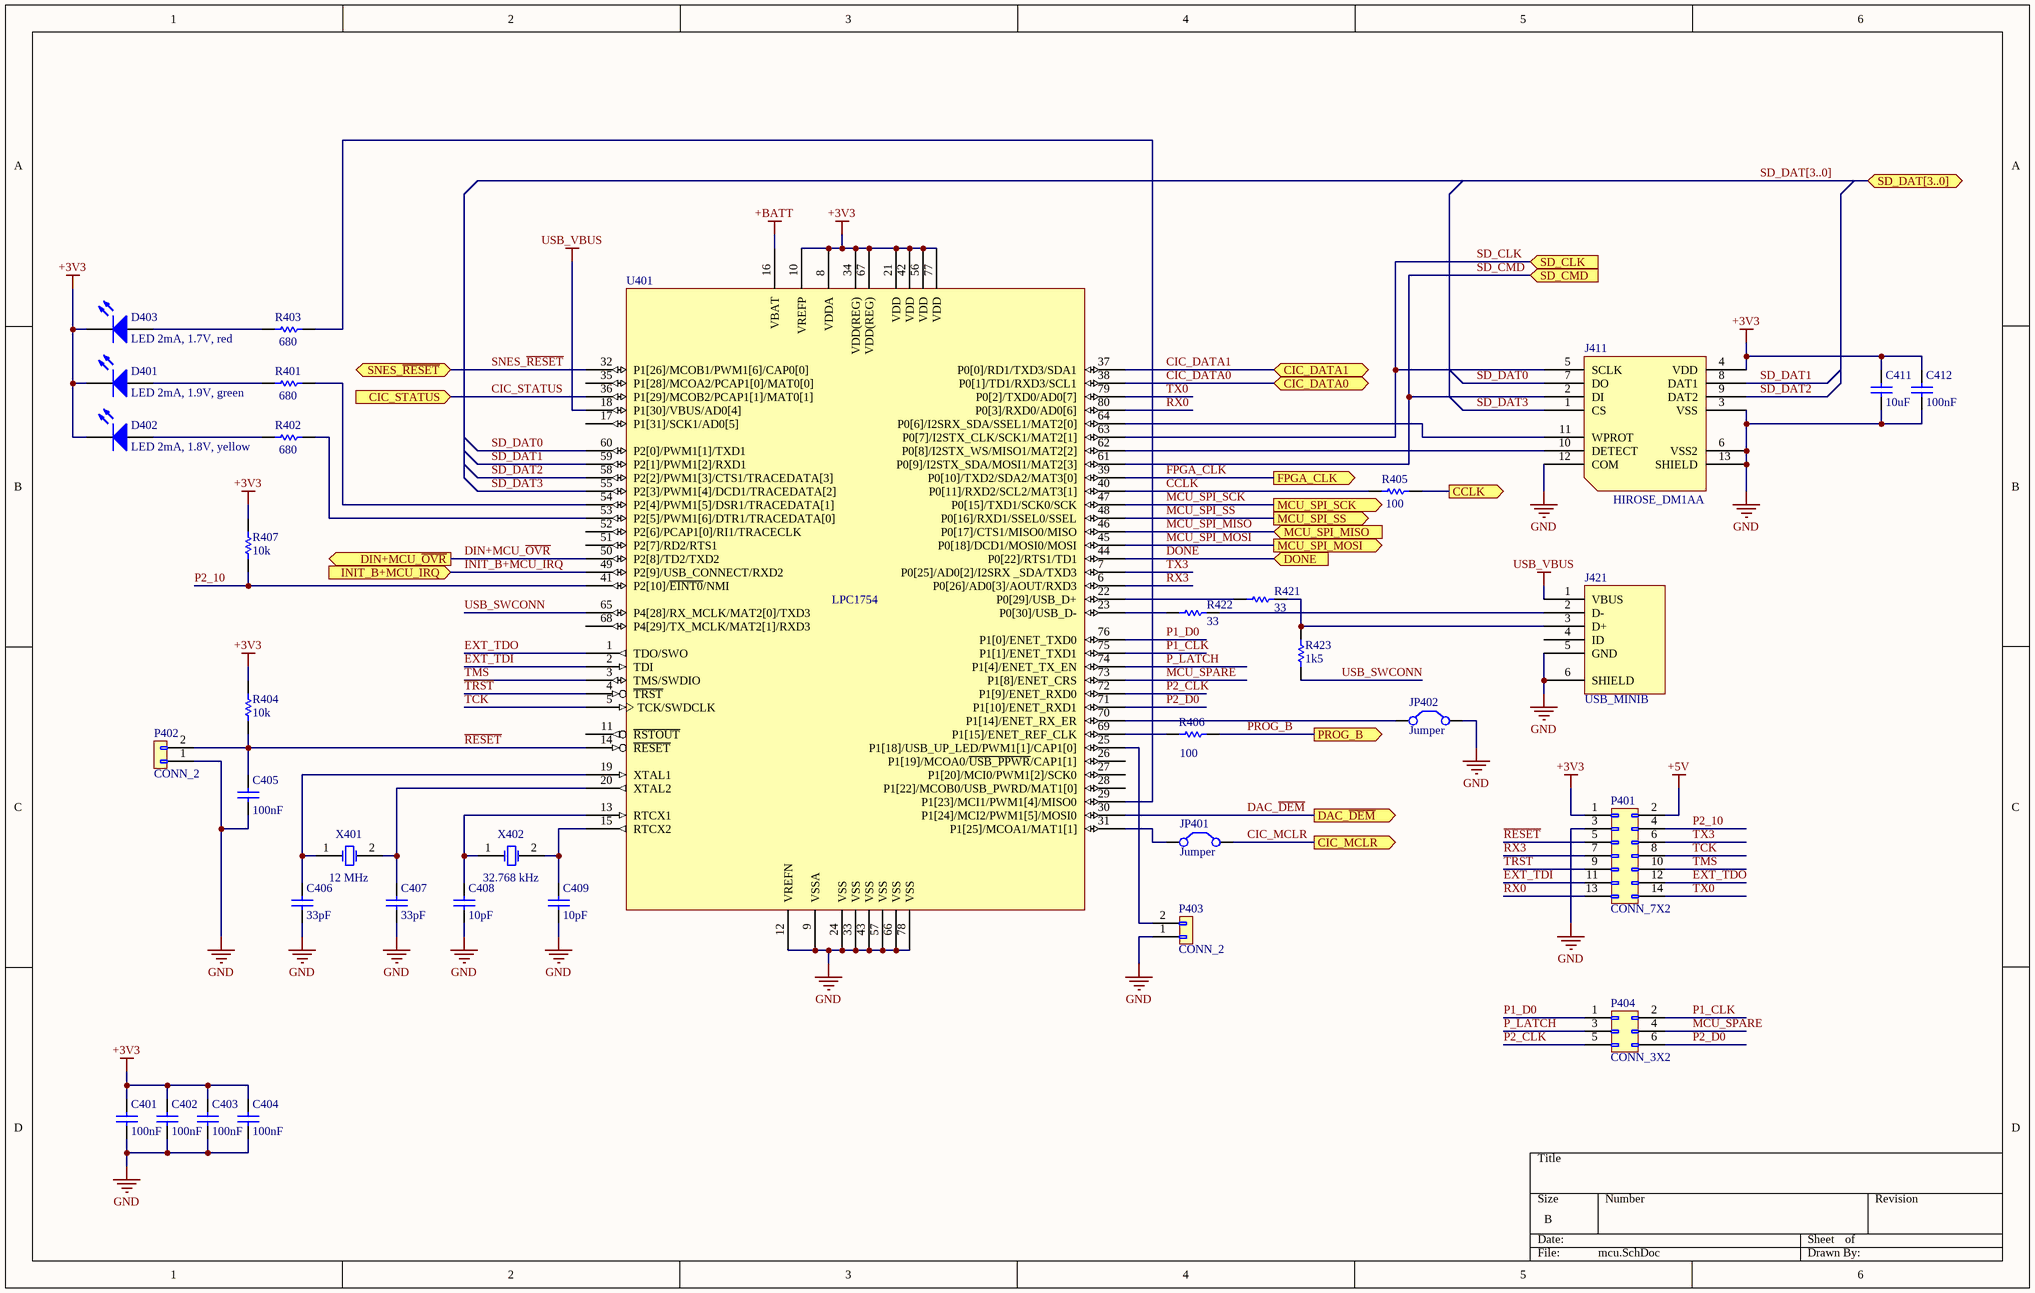
[diagram p4: mcu.SchDoc]

### Parts
C401  100nF  [SM0805]
C402  100nF  [SM0805]
C403  100nF  [SM0805]
C404  100nF  [SM0805]
C405  100nF  [SM0805]
C406  33pF  [SM0805]
C407  33pF  [SM0805]
C408  10pF  [SM0805]
C409  10pF  [SM0805]
C411  10uF  [SM0805]
C412  100nF  [SM0805]
D401  LED 2mA, 1.9V, green  [LED-3MM-FIXED]
D402  LED 2mA, 1.8V, yellow  [LED-3MM-FIXED]
D403  LED 2mA, 1.7V, red  [LED-3MM-FIXED]
J411  HIROSE_DM1AA  [HRS-DM1AA]
J421  USB_MINIB  [USB-MINIB]
JP401  Jumper  [JUMPER]
JP402  Jumper  [JUMPER]
P401  CONN_7X2  [PIN_ARRAY_7X2]
P402  CONN_2  [PIN_ARRAY_2X1]
P403  CONN_2  [PIN_ARRAY_2X1]
P404  CONN_3X2  [PIN_ARRAY_3X2]
R401  680  [SM0805]
R402  680  [SM0805]
R403  680  [SM0805]
R404  10k  [SM0805]
R405  100  [SM0805]
R406  100  [SM0805]
R407  10k  [SM0805]
R421  33  [SM0805]
R422  33  [SM0805]
R423  1k5  [SM0805]
U401  LPC1754  [LQFP80-.5]
X401  12 MHz  [XTAL_SMD_05032]
X402  32.768 kHz  [XTAL_SMD_05019]

### Ports
CCLK (out), CIC_DATA0 (bidir), CIC_DATA1 (bidir), CIC_MCLR (out), CIC_STATUS (in), DAC_~{DEM} (out), DIN+MCU_~{OVR} (out), DONE (in), FPGA_CLK (out), INIT_B+MCU_IRQ (in), MCU_SPI_MISO (in), MCU_SPI_MOSI (out), MCU_SPI_SCK (out), MCU_SPI_SS (out), PROG_B (out), SD_CLK (in), SD_CMD (in), SD_DAT[3..0] (bidir), SNES_~{RESET} (bidir)

### Nets
+3V3: C401.1 C402.1 C403.1 C404.1 C411.1 C412.1 D401.2(K) D402.2(K) D403.2(K) J411.4(VDD) P401.1 R404.2 R407.2 U401.8(VDDA) U401.10(VREFP) U401.21(VDD) U401.34(VDD(REG)) U401.42(VDD) U401.56(VDD) U401.67(VDD(REG)) U401.77(VDD)
+5V: P401.2
+BATT: U401.16(VBAT)
GND: C401.2 C402.2 C403.2 C404.2 C405.2 C406.2 C407.2 C408.2 C409.2 C411.2 C412.2 J411.3(VSS) J411.6(VSS2) J411.12(COM) J411.13(SHIELD) J421.5(GND) J421.6(SHIELD) JP402.1(C1) P401.3 P402.1 P403.1 U401.9(VSSA) U401.12(VREFN) U401.24(VSS) U401.33(VSS) U401.43(VSS) U401.57(VSS) U401.66(VSS) U401.78(VSS)
USB_VBUS: J421.1(VBUS) U401.18(P1[30]/VBUS/AD0[4])
CCLK: R405.2 U401.40(P0[11]/RXD2/SCL2/MAT3[1])
CIC_DATA0: U401.38(P0[1]/TD1/RXD3/SCL1) ; port CIC_DATA0
CIC_DATA1: U401.37(P0[0]/RD1/TXD3/SDA1) ; port CIC_DATA1
CIC_MCLR: JP401.2(C2) ; port CIC_MCLR
CIC_STATUS: U401.36(P1[29]/MCOB2/PCAP1[1]/MAT0[1]) ; port CIC_STATUS
DAC_~{DEM}: U401.30(P1[24]/MCI2/PWM1[5]/MOSI0) ; port DAC_~{DEM}
DIN+MCU_~{OVR}: U401.50(P2[8]/TD2/TXD2) ; port DIN+MCU_~{OVR}
DONE: U401.44(P0[22]/RTS1/TD1) ; port DONE
EXT_TDI: P401.11 U401.2(TDI)
EXT_TDO: P401.12 U401.1(TDO/SWO)
FPGA_CLK: U401.39(P0[10]/TXD2/SDA2/MAT3[0]) ; port FPGA_CLK
INIT_B+MCU_IRQ: U401.49(P2[9]/USB_CONNECT/RXD2) ; port INIT_B+MCU_IRQ
MCU_SPARE: P404.4 U401.73(P1[8]/ENET_CRS)
MCU_SPI_MISO: U401.46(P0[17]/CTS1/MISO0/MISO) ; port MCU_SPI_MISO
MCU_SPI_MOSI: U401.45(P0[18]/DCD1/MOSI0/MOSI) ; port MCU_SPI_MOSI
MCU_SPI_SCK: U401.47(P0[15]/TXD1/SCK0/SCK) ; port MCU_SPI_SCK
MCU_SPI_SS: U401.48(P0[16]/RXD1/SSEL0/SSEL) ; port MCU_SPI_SS
P1_CLK: P404.2 U401.75(P1[1]/ENET_TXD1)
P1_D0: P404.1 U401.76(P1[0]/ENET_TXD0)
P2_10: P401.4 R407.1 U401.41(P2[10]/~{EINT0}/NMI)
P2_CLK: P404.5 U401.72(P1[9]/ENET_RXD0)
P2_D0: P404.6 U401.71(P1[10]/ENET_RXD1)
P_LATCH: P404.3 U401.74(P1[4]/ENET_TX_EN)
PROG_B: R406.2 ; port PROG_B
~{RESET}: C405.1 P401.5 P402.2 R404.1 U401.14(~{RESET})
RX0: P401.13 U401.80(P0[3]/RXD0/AD0[6])
RX3: P401.7 U401.6(P0[26]/AD0[3]/AOUT/RXD3)
SD_CLK: J411.5(SCLK) U401.63(P0[7]/I2STX_CLK/SCK1/MAT2[1]) ; port SD_CLK
SD_CMD: J411.2(DI) U401.61(P0[9]/I2STX_SDA/MOSI1/MAT2[3]) ; port SD_CMD
SD_DAT0: J411.7(DO) U401.60(P2[0]/PWM1[1]/TXD1)
SD_DAT1: J411.8(DAT1) U401.59(P2[1]/PWM1[2]/RXD1)
SD_DAT2: J411.9(DAT2) U401.58(P2[2]/PWM1[3]/CTS1/TRACEDATA[3])
SD_DAT3: J411.1(CS) U401.55(P2[3]/PWM1[4]/DCD1/TRACEDATA[2])
SNES_~{RESET}: U401.32(P1[26]/MCOB1/PWM1[6]/CAP0[0]) ; port SNES_~{RESET}
~{TRST}: P401.9 U401.4(~{TRST})
TCK: P401.8 U401.5(TCK/SWDCLK)
TMS: P401.10 U401.3(TMS/SWDIO)
TX0: P401.14 U401.79(P0[2]/TXD0/AD0[7])
TX3: P401.6 U401.7(P0[25]/AD0[2]/I2SRX__SDA/TXD3)
USB_SWCONN: R423.1 U401.65(P4[28]/RX_MCLK/MAT2[0]/TXD3)
NetC406_1: C406.1 U401.19(XTAL1) X401.1(OSC1)
NetC407_1: C407.1 U401.20(XTAL2) X401.2(OSC2)
NetC408_1: C408.1 U401.13(RTCX1) X402.1(OSC1)
NetC409_1: C409.1 U401.15(RTCX2) X402.2(OSC2)
NetD401_1: D401.1(A) R401.2
NetD402_1: D402.1(A) R402.2
NetD403_1: D403.1(A) R403.2
NetJ411_10: J411.10(DETECT) U401.62(P0[8]/I2STX_WS/MISO1/MAT2[2])
NetJ411_11: J411.11(WPROT) U401.64(P0[6]/I2SRX_SDA/SSEL1/MAT2[0])
NetJ421_2: J421.2(D-) R422.1
NetJ421_3: J421.3(D+) R421.1 R423.2
NetJP401_1: JP401.1(C1) U401.31(P1[25]/MCOA1/MAT1[1])
NetJP402_2: JP402.2(C2) U401.70(P1[14]/ENET_RX_ER)
NetP403_2: P403.2 U401.25(P1[18]/USB_UP_LED/PWM1[1]/CAP1[0])
NetR401_1: R401.1 U401.54(P2[4]/PWM1[5]/DSR1/TRACEDATA[1])
NetR402_1: R402.1 U401.53(P2[5]/PWM1[6]/DTR1/TRACEDATA[0])
NetR403_1: R403.1 U401.29(P1[23]/MCI1/PWM1[4]/MISO0)
NetR405_1: R405.1 ; port CCLK
NetR406_1: R406.1 U401.69(P1[15]/ENET_REF_CLK)
NetR421_2: R421.2 U401.22(P0[29]/USB_D+)
NetR422_2: R422.2 U401.23(P0[30]/USB_D-)

Not connected (* = marked no-connect by the designer): J421 4(ID); U401 11(~{RSTOUT}) 17(P1[31]/SCK1/AD0[5]) 26(P1[19]/MCOA0/~{USB_PPWR}/CAP1[1]) 27(P1[20]/MCI0/PWM1[2]/SCK0) 28(P1[22]/MCOB0/USB_PWRD/MAT1[0]) 35(P1[28]/MCOA2/PCAP1[0]/MAT0[0]) 51(P2[7]/RD2/RTS1) 52(P2[6]/PCAP1[0]/RI1/TRACECLK) 68(P4[29]/TX_MCLK/MAT2[1]/RXD3)

### Buses and harness runs
bus SD_DAT[3..0] = port SD_DAT[3..0]

### Library data of the parts
C401-C409 C411 C412 = Cap: Capacitor
  C401-C405 C412: Value: 100nF
  C406 C407: Value: 33pF
  C408 C409: Value: 10pF
  C411: Value: 10uF
D401 = LED0: LED, 3mm Round, Diffused, Green
D402 = LED0: LED, 3mm Round, Diffused, Yellow
D403 = LED0: LED, 3mm Round, Diffused, Red
J411 = DM1AA
JP401 JP402 = Jumper: Jumper Wire
R401-R407 R421-R423 = Res1: Resistor
  R401-R403: Value: 680
  R404 R407: Value: 10k
  R405 R406: Value: 100
  R421 R422: Value: 33
  R423: Value: 1k5
X401 X402 = XTAL: Crystal Oscillator

## Sheet pwr_misc.SchDoc
size B
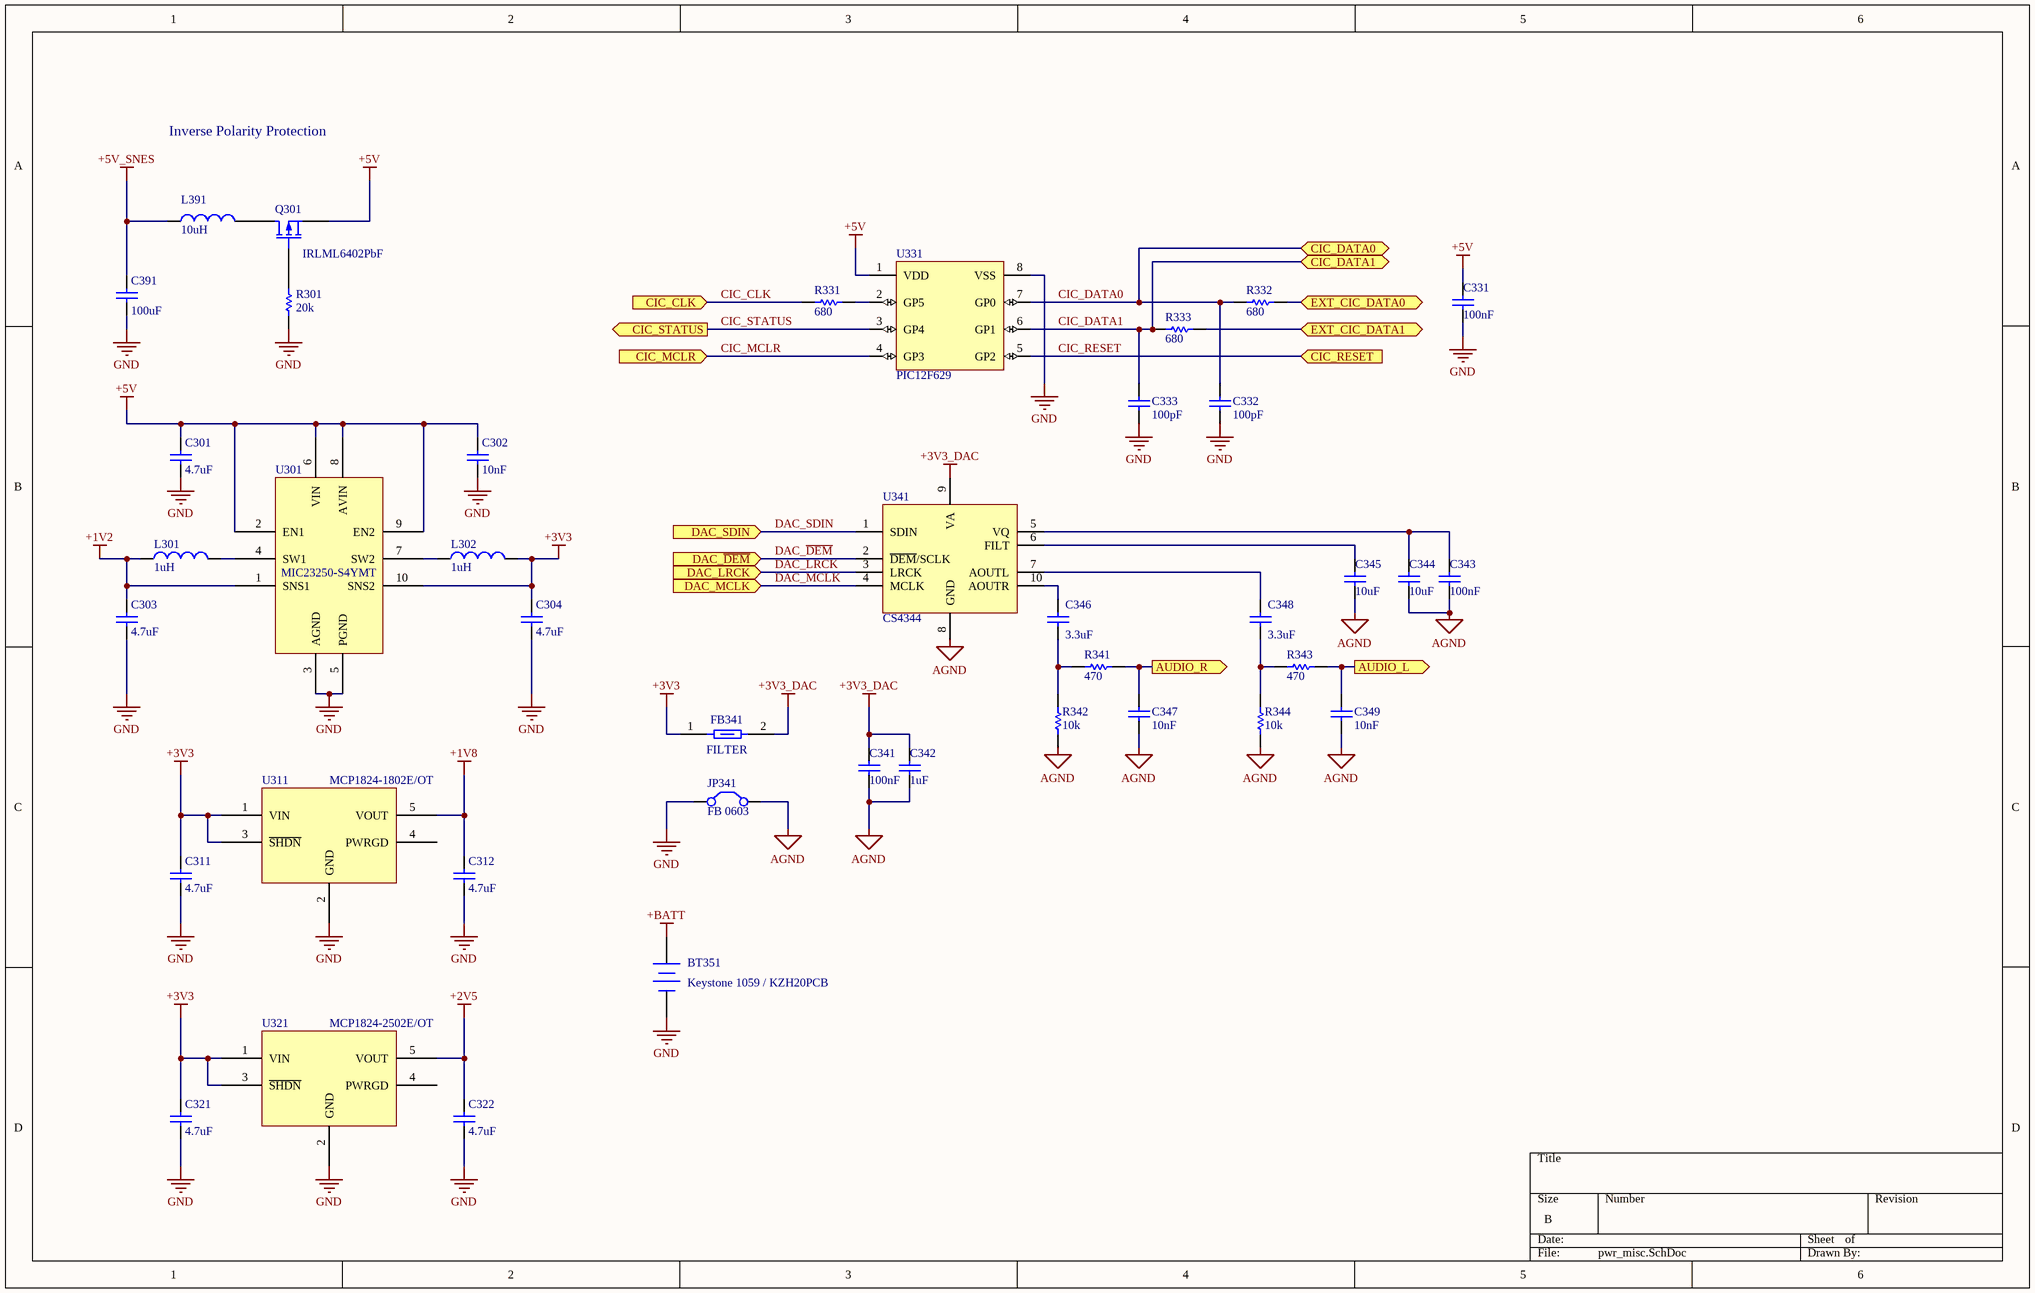
[diagram p5: pwr_misc.SchDoc]

### Parts
BT351  Keystone 1059 / KZH20PCB  [BT_KEYSTONE_1059_20MM]
C301  4.7uF  [SM0805]
C302  10nF  [SM0805]
C303  4.7uF  [SM0805]
C304  4.7uF  [SM0805]
C311  4.7uF  [SM0805]
C312  4.7uF  [SM0805]
C321  4.7uF  [SM0805]
C322  4.7uF  [SM0805]
C331  100nF  [SM0805]
C332  100pF  [SM0805]
C333  100pF  [SM0805]
C341  100nF  [SM0805]
C342  1uF  [SM0805]
C343  100nF  [SM0805]
C344  10uF  [SM0805]
C345  10uF  [SM0805]
C346  3.3uF  [SM0805]
C347  10nF  [SM0805]
C348  3.3uF  [SM0805]
C349  10nF  [SM0805]
C391  100uF  [SM1210]
FB341  FILTER  [SM0805]
JP341  FB 0603  [JUMPER]
L301  1uH  [SM1210L]
L302  1uH  [SM1210L]
L391  10uH  [SM1210L]
Q301  IRLML6402PbF  [SOT23DGS]
R301  20k  [SM0805]
R331  680  [SM0805]
R332  680  [SM0805]
R333  680  [SM0805]
R341  470  [SM0805]
R342  10k  [SM0805]
R343  470  [SM0805]
R344  10k  [SM0805]
U301  MIC23250-S4YMT  [QFN10-2x2_LONGPADS]
U311  MCP1824-1802E/OT  [SOT23-5_LARGEPADS]
U321  MCP1824-2502E/OT  [SOT23-5_LARGEPADS]
U331  PIC12F629  [DIP-8__300]
U341  CS4344  [TSSOP10]

### Ports
AUDIO_L (out), AUDIO_R (out), CIC_CLK (in), CIC_DATA0 (bidir), CIC_DATA1 (bidir), CIC_MCLR (in), CIC_RESET (in), CIC_STATUS (out), DAC_LRCK (in), DAC_MCLK (in), DAC_SDIN (in), DAC_~{DEM} (in), EXT_CIC_DATA0 (bidir), EXT_CIC_DATA1 (bidir)

### Nets
+1V2: C303.1 L301.1 U301.1(SNS1)
+1V8: C312.1 U311.5(VOUT)
+2V5: C322.1 U321.5(VOUT)
+3V3: C304.1 C311.1 C321.1 FB341.1 L302.2 U301.10(SNS2) U311.1(VIN) U311.3(~{SHDN}) U321.1(VIN) U321.3(~{SHDN})
+3V3_DAC: C341.1 C342.1 FB341.2 U341.9(VA)
+5V: C301.1 C302.1 C331.1 Q301.3(S) U301.2(EN1) U301.6(VIN) U301.8(AVIN) U301.9(EN2) U331.1(VDD)
+5V_SNES: C391.1 L391.1
+BATT: BT351.1(+)
AGND: C341.2 C342.2 C343.2 C344.2 C345.2 C347.2 C349.2 JP341.2(C2) R342.2 R344.2 U341.8(GND)
GND: BT351.2(-) C301.2 C302.2 C303.2 C304.2 C311.2 C312.2 C321.2 C322.2 C331.2 C332.2 C333.2 C391.2 JP341.1(C1) R301.1 U301.3(AGND) U301.5(PGND) U311.2(GND) U321.2(GND) U331.8(VSS)
AUDIO_L: C349.1 R343.1 ; port AUDIO_L
AUDIO_R: C347.1 R341.1 ; port AUDIO_R
CIC_CLK: R331.2 ; port CIC_CLK
CIC_DATA0: C332.1 R332.1 U331.7(GP0) ; port CIC_DATA0
CIC_DATA1: C333.1 R333.2 U331.6(GP1) ; port CIC_DATA1
CIC_MCLR: U331.4(GP3) ; port CIC_MCLR
CIC_RESET: U331.5(GP2) ; port CIC_RESET
CIC_STATUS: U331.3(GP4) ; port CIC_STATUS
DAC_~{DEM}: U341.2(~{DEM}/SCLK) ; port DAC_~{DEM}
DAC_LRCK: U341.3(LRCK) ; port DAC_LRCK
DAC_MCLK: U341.4(MCLK) ; port DAC_MCLK
DAC_SDIN: U341.1(SDIN) ; port DAC_SDIN
EXT_CIC_DATA0: R332.2 ; port EXT_CIC_DATA0
EXT_CIC_DATA1: R333.1 ; port EXT_CIC_DATA1
NetC343_1: C343.1 C344.1 U341.5(VQ)
NetC345_1: C345.1 U341.6(FILT)
NetC346_1: C346.1 R341.2 R342.1
NetC346_2: C346.2 U341.10(AOUTR)
NetC348_1: C348.1 R343.2 R344.1
NetC348_2: C348.2 U341.7(AOUTL)
NetL301_2: L301.2 U301.4(SW1)
NetL302_1: L302.1 U301.7(SW2)
NetL391_2: L391.2 Q301.1(D)
NetQ301_2: Q301.2(G) R301.2
NetR331_1: R331.1 U331.2(GP5)

Not connected (* = marked no-connect by the designer): U311 4(PWRGD); U321 4(PWRGD)

### Notes on the sheet
- Inverse Polarity Protection

### Library data of the parts
BT351 = Battery
C301-C304 C311 C312 C321 C322 C331-C333 C341-C349 C391 = Cap: Capacitor
  C301 C303 C304 C311 C312 C321 C322: Value: 4.7uF
  C302 C347 C349: Value: 10nF
  C331 C341 C343: Value: 100nF
  C332 C333: Value: 100pF
  C342: Value: 1uF
  C344 C345: Value: 10uF
  C346 C348: Value: 3.3uF
  C391: Value: 100uF
JP341 = Jumper: Jumper Wire
L301 L302 L391 = Inductor
  L301 L302: Value: 1uH
  L391: Value: 10uH
Q301 = MOSFET-P: P-Channel MOSFET
R301 R331-R333 R341-R344 = Res1: Resistor
  R301: Value: 20k
  R331-R333: Value: 680
  R341 R343: Value: 470
  R342 R344: Value: 10k
U311 U321 = MCP1824

## Nets that join several sheets
+1V2: fpga (8 pins), pwr_misc (C303.1 L301.1 U301.1)
+1V8: memory (C502.1 U501.D6), pwr_misc (C312.1 U311.5)
+2V5: fpga (14 pins), pwr_misc (C322.1 U321.5)
+3V3: snesslot (12 pins), fpga (29 pins), memory (C501.1 D511.2 R512.2 U501.E1), mcu (21 pins), pwr_misc (10 pins)
+5V: snesslot (12 pins), mcu (P401.2), pwr_misc (9 pins)
+5V_SNES: snesslot (J101.27 J101.58), pwr_misc (C391.1 L391.1)
+BATT: memory (D511.1), mcu (U401.16), pwr_misc (BT351.1)
GND: snesslot (59 pins), fpga (52 pins), memory (11 pins), mcu (29 pins), pwr_misc (20 pins)
AUDIO_L: snesslot (J101.31), pwr_misc (C349.1 R343.1)
AUDIO_R: snesslot (J101.62), pwr_misc (C347.1 R341.1)
CIC_CLK: snesslot (J101.56), pwr_misc (R331.2)
CIC_DATA0: mcu (U401.38), pwr_misc (C332.1 R332.1 U331.7)
CIC_DATA1: mcu (U401.37), pwr_misc (C333.1 R333.2 U331.6)
CIC_MCLR: mcu (JP401.2), pwr_misc (U331.4)
CIC_RESET: snesslot (J101.25), pwr_misc (U331.5)
CIC_STATUS: mcu (U401.36), pwr_misc (U331.3)
DAC_~{DEM}: mcu (U401.30), pwr_misc (U341.2)
DAC_LRCK: fpga (U201.77), pwr_misc (U341.3)
DAC_MCLK: fpga (U201.76), pwr_misc (U341.4)
DAC_SDIN: fpga (U201.78), pwr_misc (U341.1)
DATABUS_DIR: snesslot (U101.24), fpga (U201.111)
DATABUS_~{OE}: snesslot (U101.25), fpga (U201.109)
DIN+MCU_~{OVR}: fpga (U201.92), mcu (U401.50)
DONE: fpga (U201.103), mcu (U401.44)
EXT_CIC_DATA0: snesslot (J101.55), pwr_misc (R332.2)
EXT_CIC_DATA1: snesslot (J101.24), pwr_misc (R333.1)
FPGA_CLK: fpga (U201.80), mcu (U401.39)
INIT_B+MCU_IRQ: fpga (U201.83), mcu (U401.49)
MCU_SPI_MISO: fpga (U201.72), mcu (U401.46)
MCU_SPI_MOSI: fpga (U201.74), mcu (U401.45)
MCU_SPI_SCK: fpga (U201.71), mcu (U401.47)
MCU_SPI_SS: fpga (U201.68), mcu (U401.48)
NetR405_1: fpga (U201.104), mcu (R405.1)
PROG_B: fpga (U201.207), mcu (R406.2)
RAM_A0: fpga (U201.28), memory (U511.12)
RAM_A1: fpga (U201.31), memory (U511.11)
RAM_A2: fpga (U201.33), memory (U511.10)
RAM_A3: fpga (U201.35), memory (U511.9)
RAM_A4: fpga (U201.37), memory (U511.8)
RAM_A5: fpga (U201.40), memory (U511.7)
RAM_A6: fpga (U201.43), memory (U511.6)
RAM_A7: fpga (U201.45), memory (U511.5)
RAM_A8: fpga (U201.44), memory (U511.27)
RAM_A9: fpga (U201.42), memory (U511.26)
RAM_A10: fpga (U201.34), memory (U511.23)
RAM_A11: fpga (U201.39), memory (U511.25)
RAM_A12: fpga (U201.48), memory (U511.4)
RAM_A13: fpga (U201.46), memory (U511.28)
RAM_A14: fpga (U201.51), memory (U511.3)
RAM_A15: fpga (U201.58), memory (U511.31)
RAM_A16: fpga (U201.57), memory (U511.2)
RAM_A17: fpga (U201.61), memory (U511.1)
RAM_A18: fpga (U201.52), memory (U511.30)
RAM_DQ0: fpga (U201.26), memory (U511.13)
RAM_DQ1: fpga (U201.22), memory (U511.14)
RAM_DQ2: fpga (U201.20), memory (U511.15)
RAM_DQ3: fpga (U201.19), memory (U511.17)
RAM_DQ4: fpga (U201.21), memory (U511.18)
RAM_DQ5: fpga (U201.24), memory (U511.19)
RAM_DQ6: fpga (U201.27), memory (U511.20)
RAM_DQ7: fpga (U201.29), memory (U511.21)
RAM_~{OE}: fpga (U201.36), memory (U511.24)
RAM_~{WE}: fpga (U201.50), memory (U511.29)
ROM_A0: fpga (U201.166), memory (U501.A3)
ROM_A1: fpga (U201.168), memory (U501.A4)
ROM_A2: fpga (U201.171), memory (U501.A5)
ROM_A3: fpga (U201.165), memory (U501.B3)
ROM_A4: fpga (U201.169), memory (U501.B4)
ROM_A5: fpga (U201.18), memory (U501.C3)
ROM_A6: fpga (U201.175), memory (U501.C4)
ROM_A7: fpga (U201.167), memory (U501.D4)
ROM_A8: fpga (U201.205), memory (U501.H2)
ROM_A9: fpga (U201.204), memory (U501.H3)
ROM_A10: fpga (U201.197), memory (U501.H4)
ROM_A11: fpga (U201.196), memory (U501.H5)
ROM_A12: fpga (U201.2), memory (U501.G3)
ROM_A13: fpga (U201.194), memory (U501.G4)
ROM_A14: fpga (U201.200), memory (U501.F3)
ROM_A15: fpga (U201.184), memory (U501.F4)
ROM_A16: fpga (U201.199), memory (U501.E4)
ROM_A17: fpga (U201.11), memory (U501.D3)
ROM_A18: fpga (U201.3), memory (U501.H1)
ROM_A19: fpga (U201.4), memory (U501.G2)
ROM_A20: fpga (U201.191), memory (U501.H6)
ROM_A21: fpga (U201.203), memory (U501.E3)
ROM_A22: fpga (U201.198), memory (U501.J4)
ROM_~{CE}: fpga (U201.172), memory (U501.B5)
ROM_DQ0: fpga (U201.176), memory (U501.B6)
ROM_DQ1: fpga (U201.178), memory (U501.C5)
ROM_DQ2: fpga (U201.181), memory (U501.C6)
ROM_DQ3: fpga (U201.182), memory (U501.D5)
ROM_DQ4: fpga (U201.183), memory (U501.E5)
ROM_DQ5: fpga (U201.187), memory (U501.F5)
ROM_DQ6: fpga (U201.185), memory (U501.F6)
ROM_DQ7: fpga (U201.189), memory (U501.G6)
ROM_DQ8: fpga (U201.16), memory (U501.B1)
ROM_DQ9: fpga (U201.13), memory (U501.C1)
ROM_DQ10: fpga (U201.15), memory (U501.C2)
ROM_DQ11: fpga (U201.12), memory (U501.D2)
ROM_DQ12: fpga (U201.10), memory (U501.E2)
ROM_DQ13: fpga (U201.7), memory (U501.F2)
ROM_DQ14: fpga (U201.9), memory (U501.F1)
ROM_DQ15: fpga (U201.5), memory (U501.G1)
ROM_~{LB}: fpga (U201.156), memory (U501.A1)
ROM_~{OE}: fpga (U201.162), memory (U501.A2)
ROM_~{UB}: fpga (U201.161), memory (U501.B2)
ROM_~{WE}: fpga (U201.190), memory (U501.G5)
SD_CLK: fpga (U201.64), mcu (J411.5 U401.63)
SD_CMD: fpga (U201.67), mcu (J411.2 U401.61)
SD_DAT0: fpga (U201.65), mcu (J411.7 U401.60)
SD_DAT1: fpga (U201.79), mcu (J411.8 U401.59)
SD_DAT2: fpga (U201.62), mcu (J411.9 U401.58)
SD_DAT3: fpga (U201.63), mcu (J411.1 U401.55)
SNES_A0: snesslot (U102.43), fpga (U201.119)
SNES_A1: snesslot (U102.40), fpga (U201.122)
SNES_A2: snesslot (U102.37), fpga (U201.124)
SNES_A3: snesslot (U102.35), fpga (U201.126)
SNES_A4: snesslot (U102.32), fpga (U201.130)
SNES_A5: snesslot (U102.29), fpga (U201.132)
SNES_A6: snesslot (U102.26), fpga (U201.135)
SNES_A7: snesslot (U103.46), fpga (U201.138)
SNES_A8: snesslot (U103.43), fpga (U201.140)
SNES_A9: snesslot (U103.40), fpga (U201.143)
SNES_A10: snesslot (U103.37), fpga (U201.146)
SNES_A11: snesslot (U103.35), fpga (U201.148)
SNES_A12: snesslot (U103.36), fpga (U201.147)
SNES_A13: snesslot (U103.38), fpga (U201.144)
SNES_A14: snesslot (U103.41), fpga (U201.141)
SNES_A15: snesslot (U103.44), fpga (U201.139)
SNES_A16: snesslot (U103.47), fpga (U201.137)
SNES_A17: snesslot (U102.27), fpga (U201.133)
SNES_A18: snesslot (U102.30), fpga (U201.131)
SNES_A19: snesslot (U102.33), fpga (U201.128)
SNES_A20: snesslot (U102.36), fpga (U201.125)
SNES_A21: snesslot (U102.38), fpga (U201.123)
SNES_A22: snesslot (U102.41), fpga (U201.120)
SNES_A23: snesslot (U102.44), fpga (U201.117)
SNES_CPU_CLK: snesslot (U101.37), fpga (U201.95)
SNES_D0: snesslot (RA114.6), fpga (U201.107)
SNES_D1: snesslot (RA114.8), fpga (U201.102)
SNES_D2: snesslot (RA113.6), fpga (U201.100)
SNES_D3: snesslot (RA113.8), fpga (U201.96)
SNES_D4: snesslot (RA114.5), fpga (U201.108)
SNES_D5: snesslot (RA114.7), fpga (U201.106)
SNES_D6: snesslot (RA113.5), fpga (U201.101)
SNES_D7: snesslot (RA113.7), fpga (U201.97)
SNES_IRQ_EN: snesslot (R103.2), fpga (U201.114)
SNES_~{PARD}: snesslot (U103.33), fpga (U201.149)
SNES_~{PAWR}: snesslot (U103.32), fpga (U201.150)
SNES_PA0: snesslot (U101.41), fpga (U201.90)
SNES_PA1: snesslot (U101.40), fpga (U201.93)
SNES_PA2: snesslot (U101.44), fpga (U201.86)
SNES_PA3: snesslot (U101.43), fpga (U201.87)
SNES_PA4: snesslot (U101.47), fpga (U201.81)
SNES_PA5: snesslot (U101.46), fpga (U201.85)
SNES_PA6: snesslot (U103.30), fpga (U201.152)
SNES_PA7: snesslot (U103.29), fpga (U201.154)
SNES_~{RD}: snesslot (U102.47), fpga (U201.115)
SNES_~{RESET}: snesslot (J101.26), mcu (U401.32)
SNES_~{ROMSEL}: snesslot (U102.46), fpga (U201.116)
SNES_REFRESH: snesslot (U103.27), fpga (U201.155)
SNES_SYS_CLK: snesslot (U103.26), fpga (U201.180)
SNES_~{WR}: snesslot (U101.38), fpga (U201.94)